# EasyEDA Pro project ProPrj_STM32音响_2025-06-08.epro, schematic Second Test

## Sheets
1 主要供电: Board Name: Second Test; Create Date: 2025-04-06; Page Name: 主要供电; Project Name: STM32多功能音响; Schematic Name: Schematic2; Update Date: 2025-04-14; Company: 嘉立创EDA; Page Size: A4; Version: V1.0
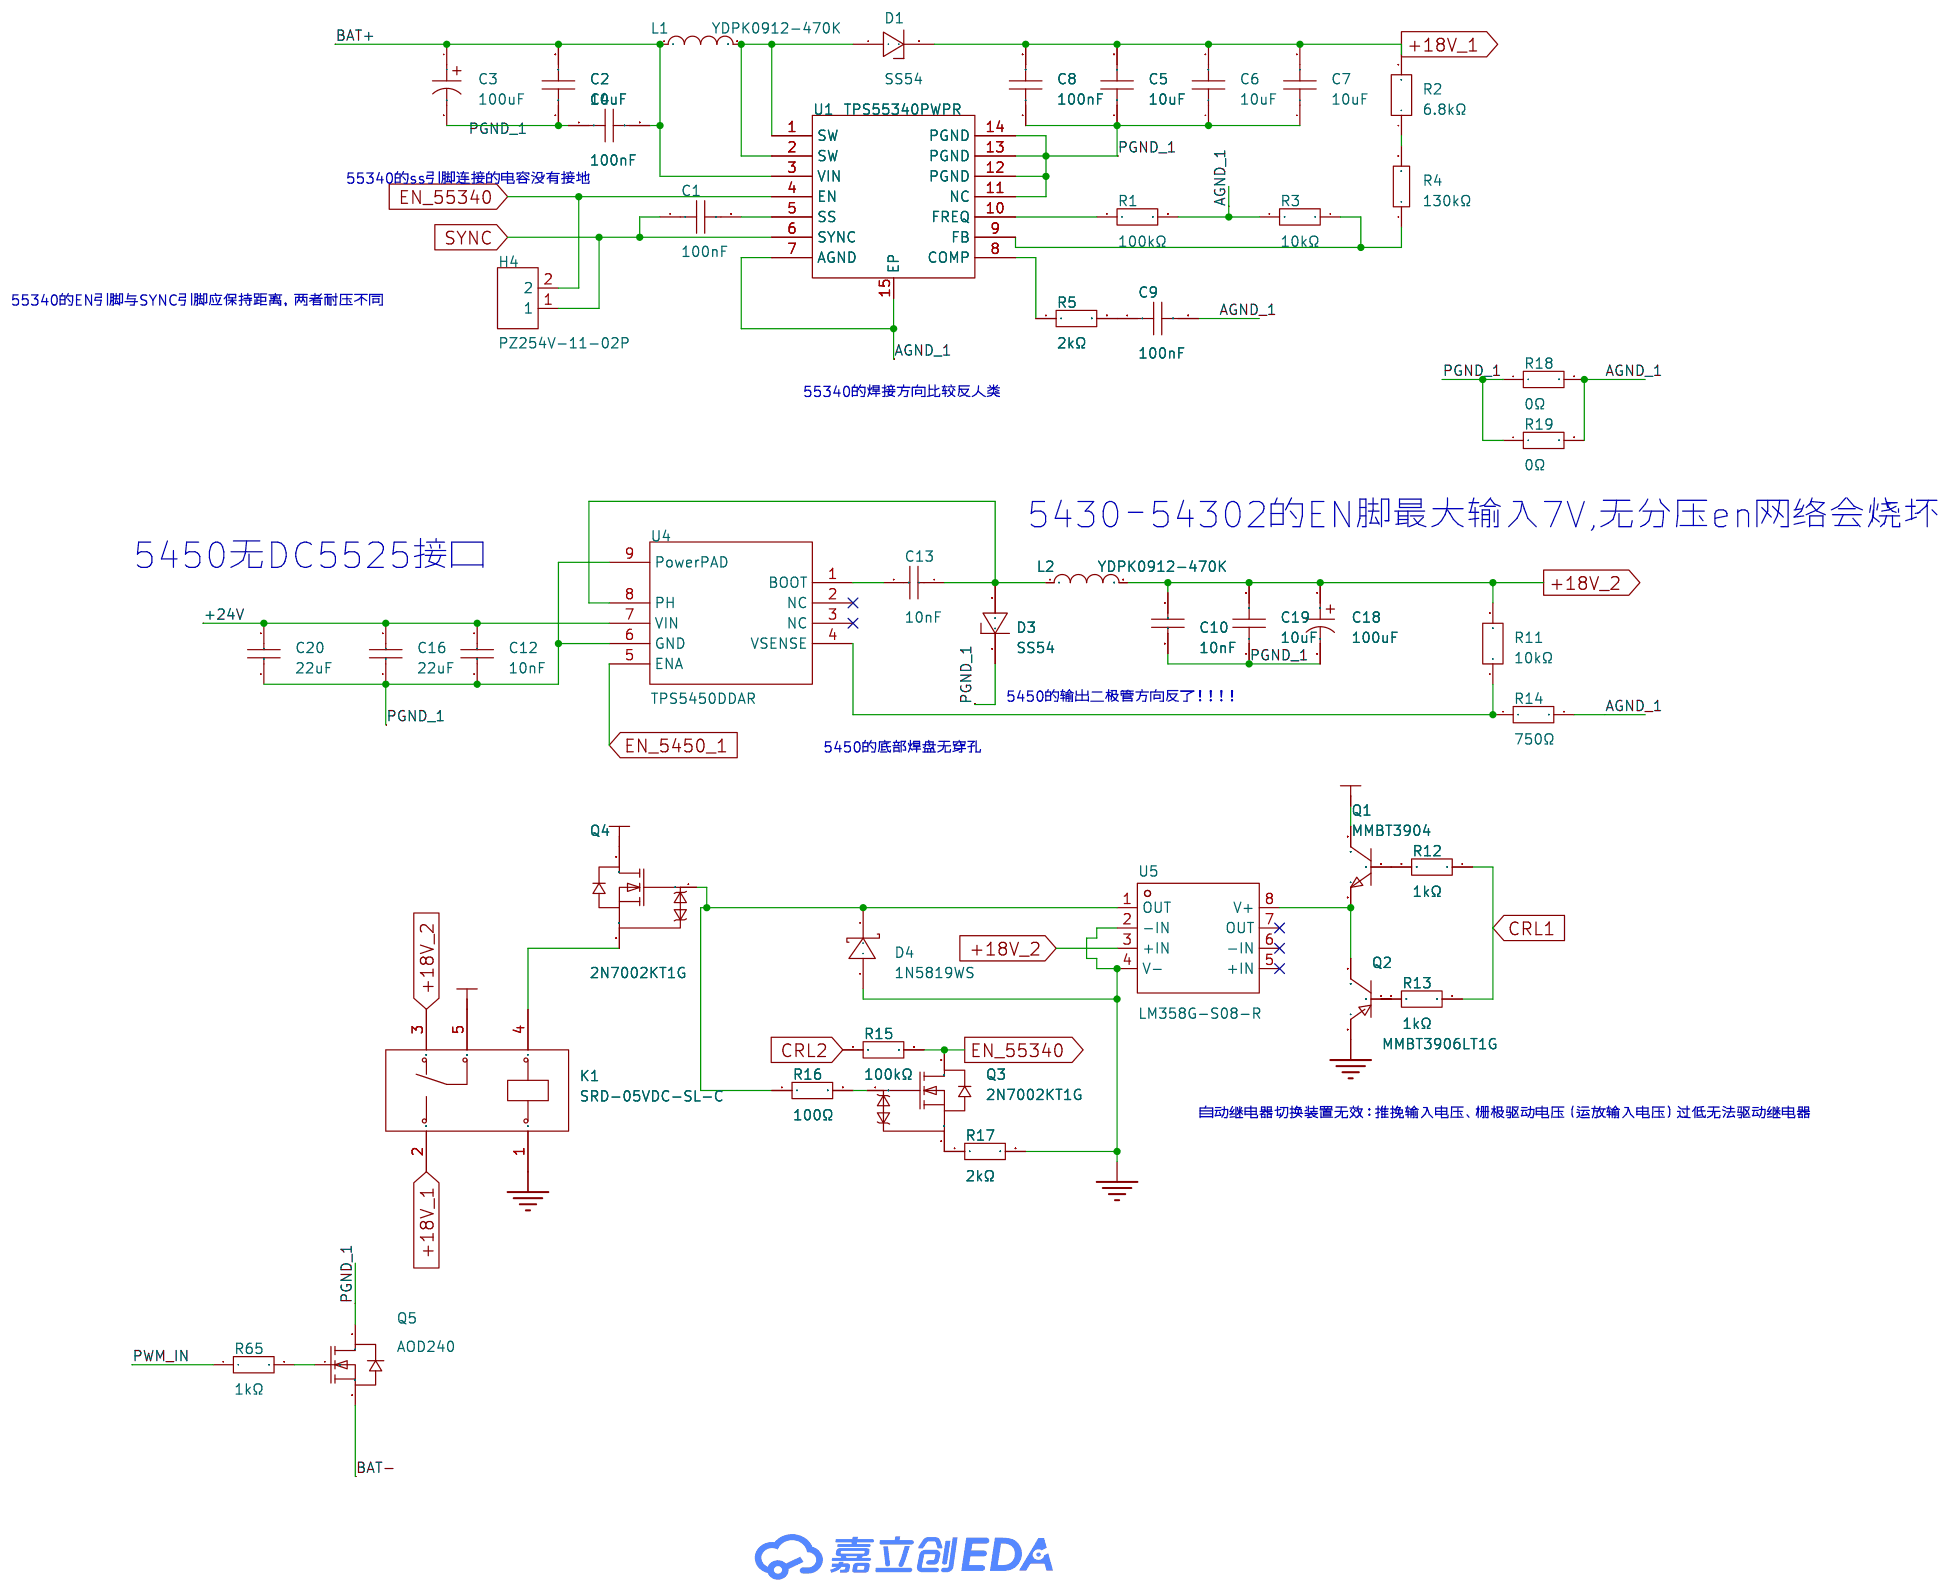
[diagram p5: 主要供电]
2 功放: Create Date: 2025-04-07; Page Name: P2; Update Date: 2025-04-12
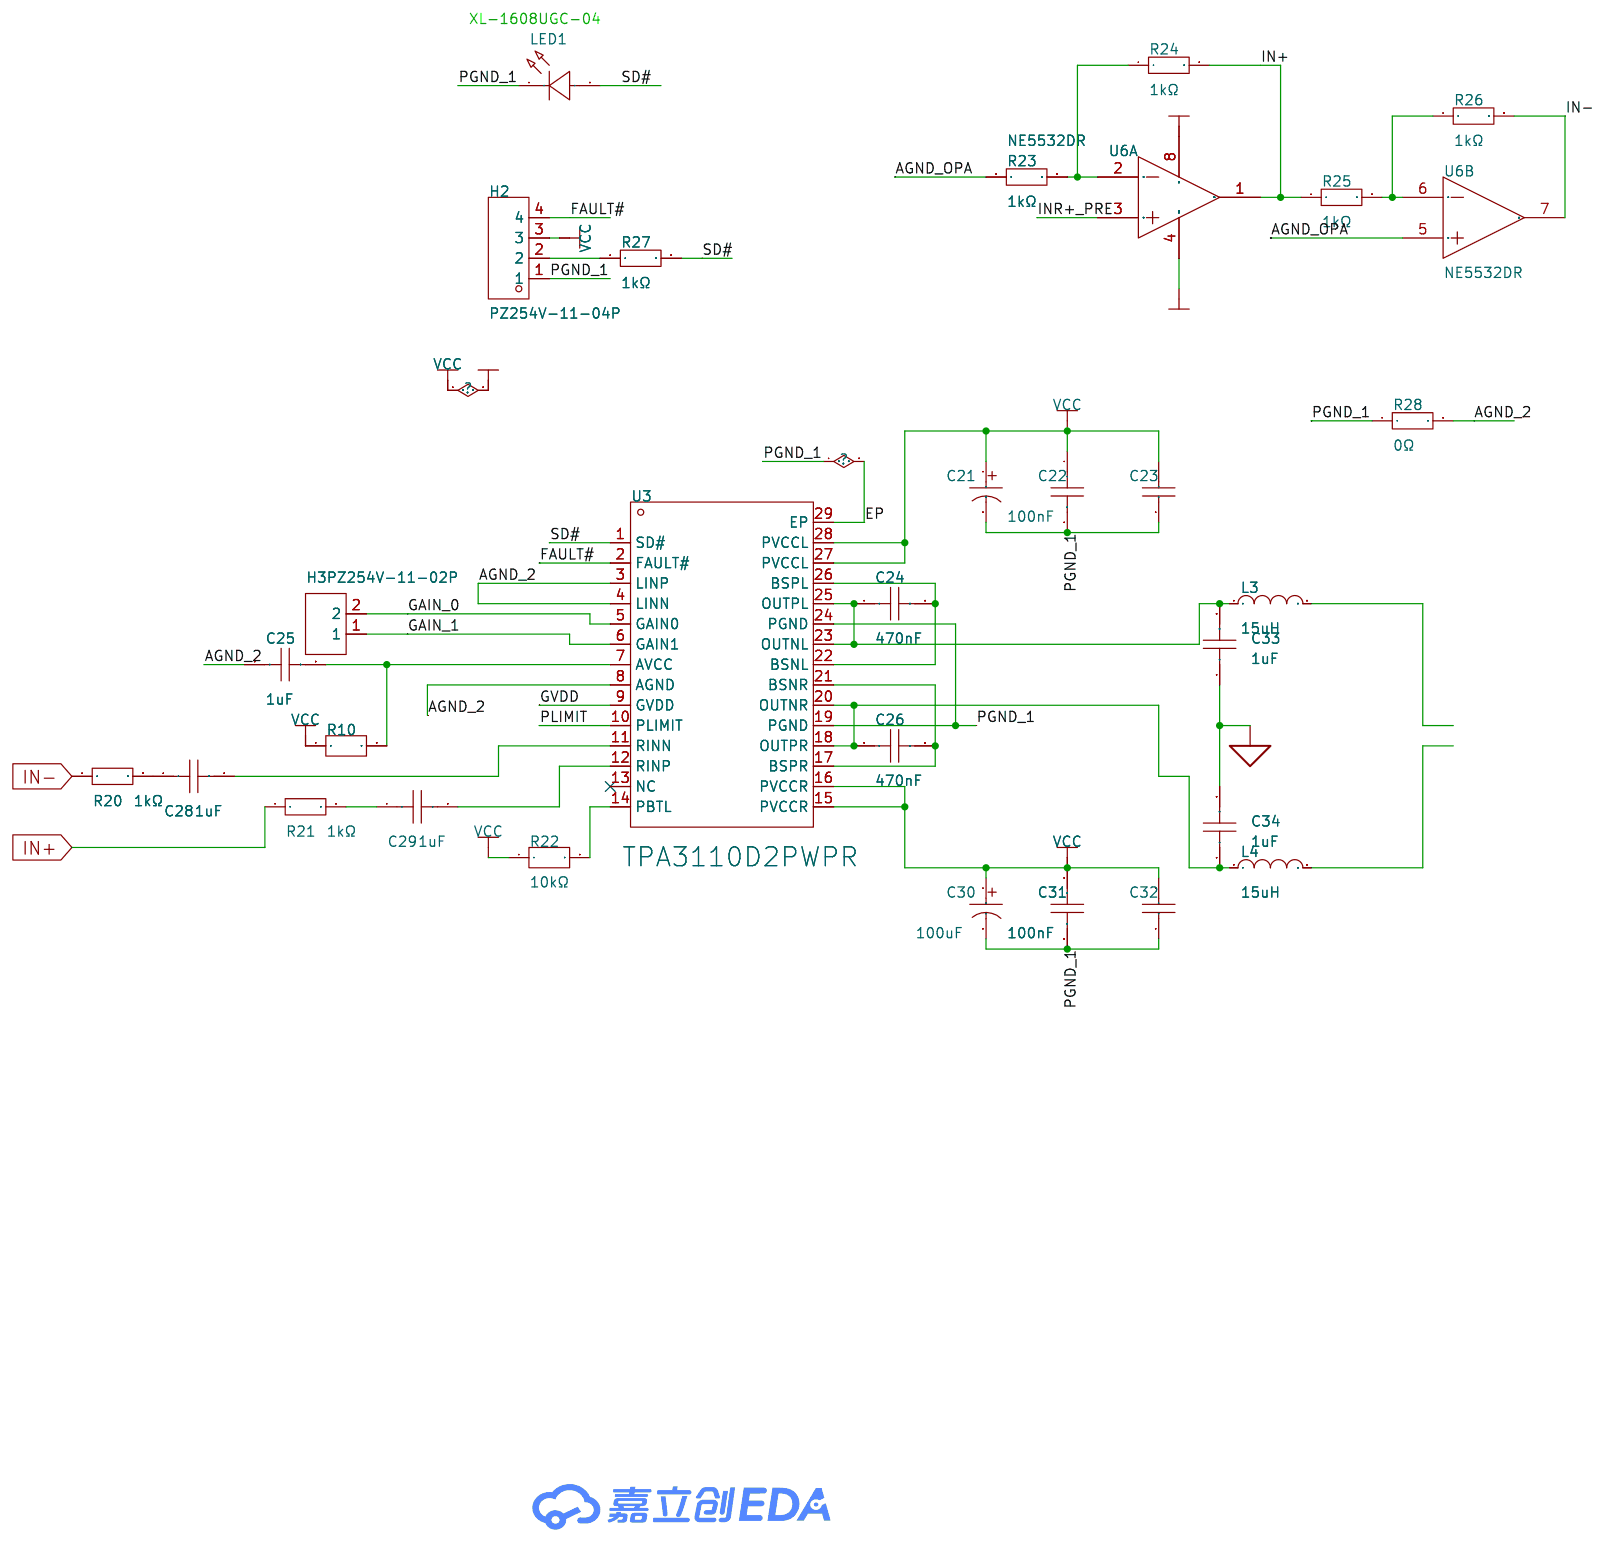
[diagram p6: 功放]
3 运放电源: Create Date: 2025-04-11; Page Name: 运放电源; Update Date: 2025-04-19
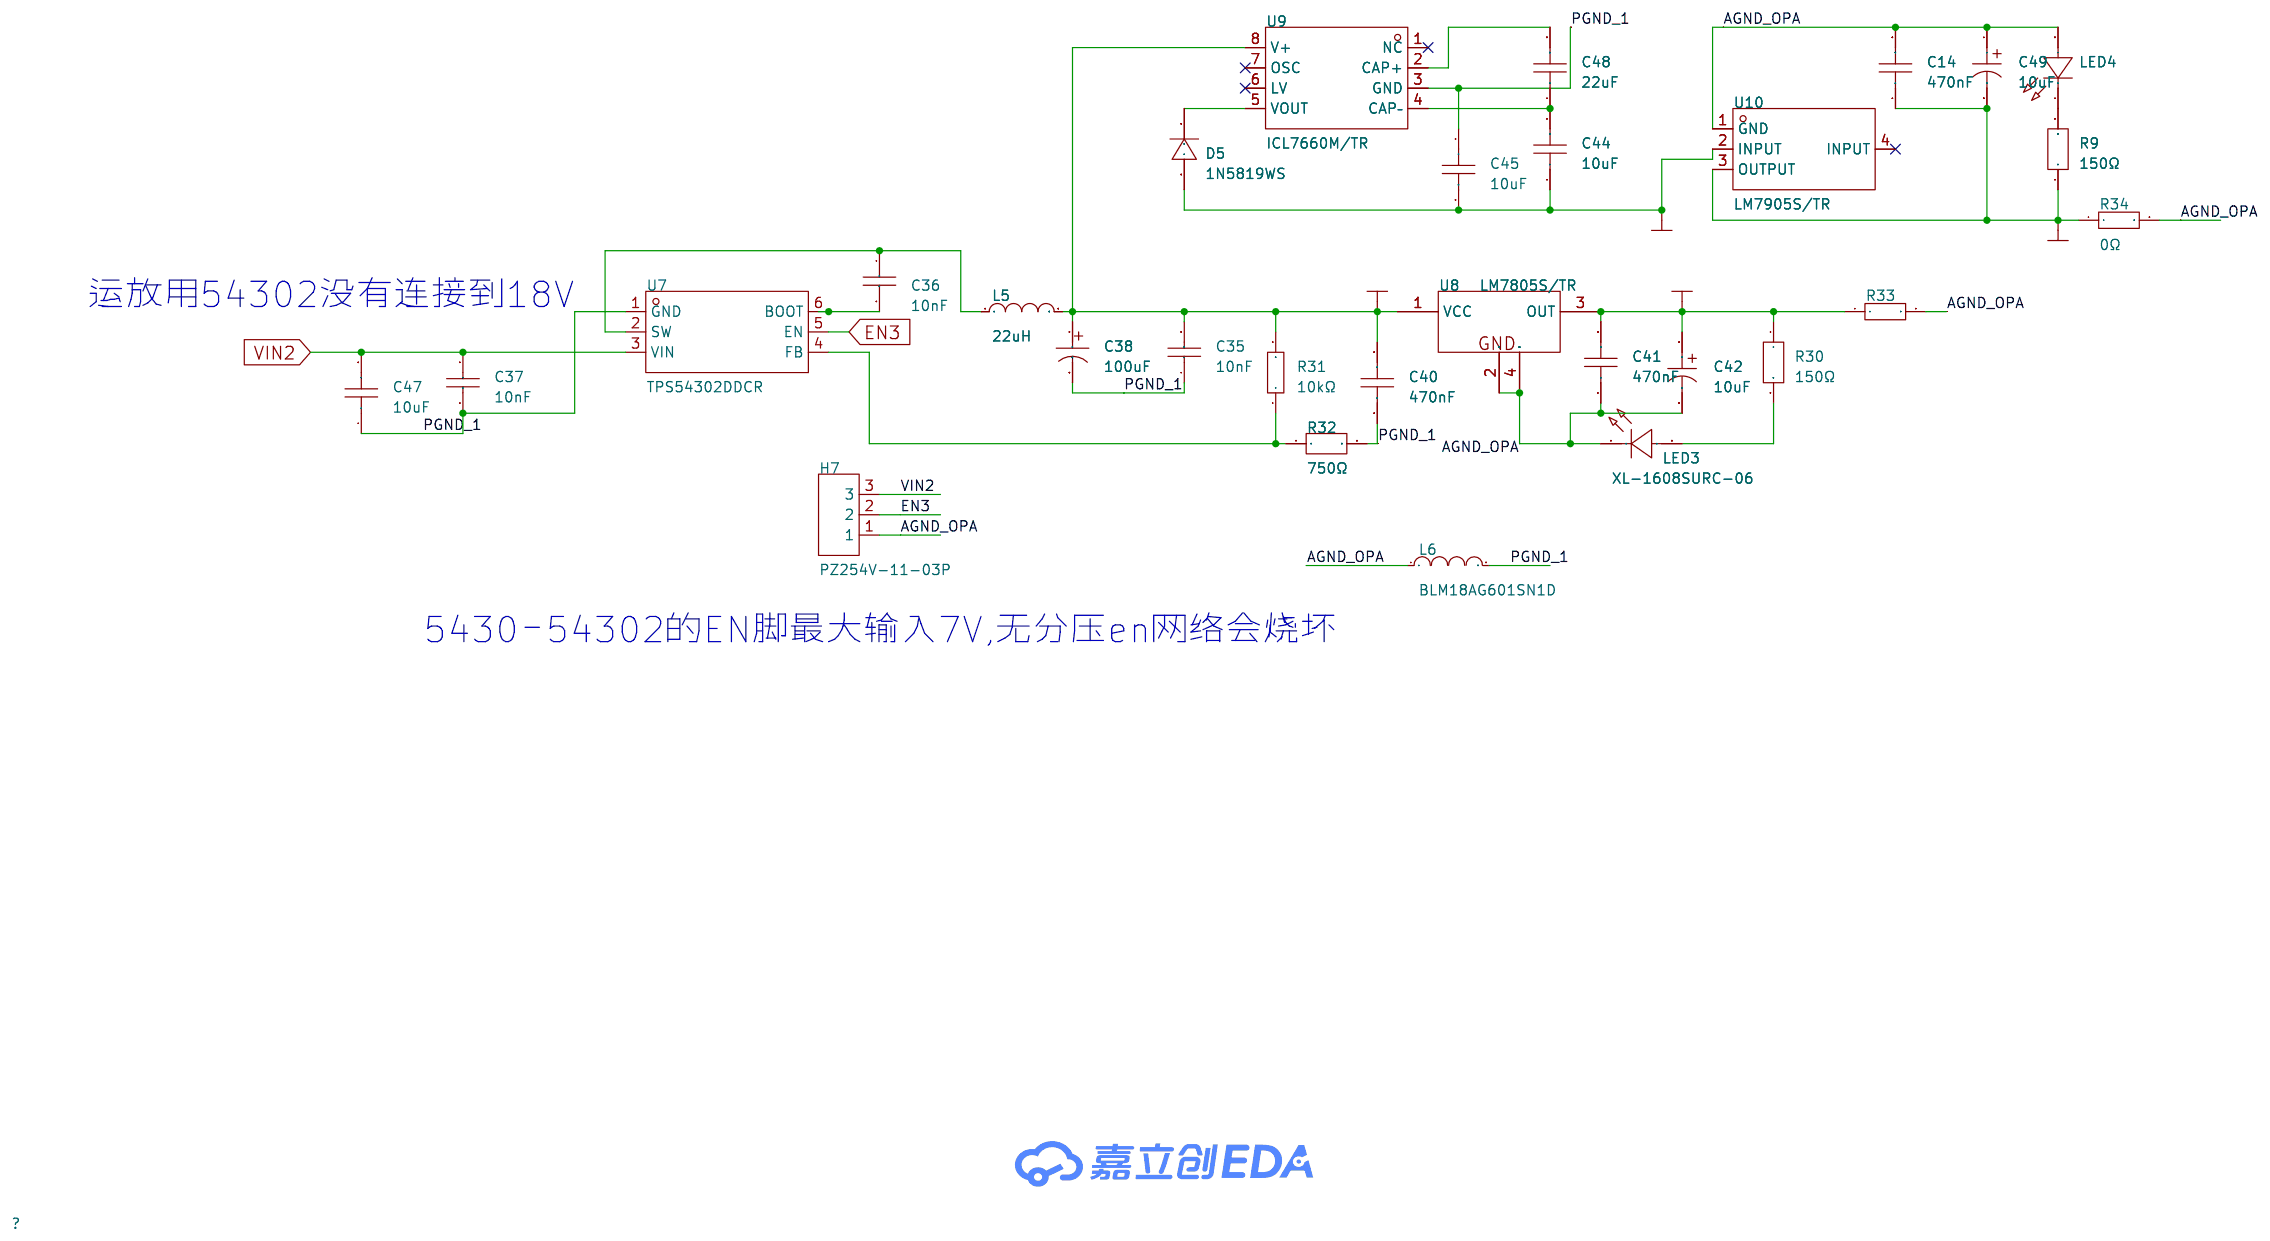
[diagram p7: 运放电源]
4 分频器: Create Date: 2025-04-13; Page Name: 分频器; Update Date: 2025-04-13
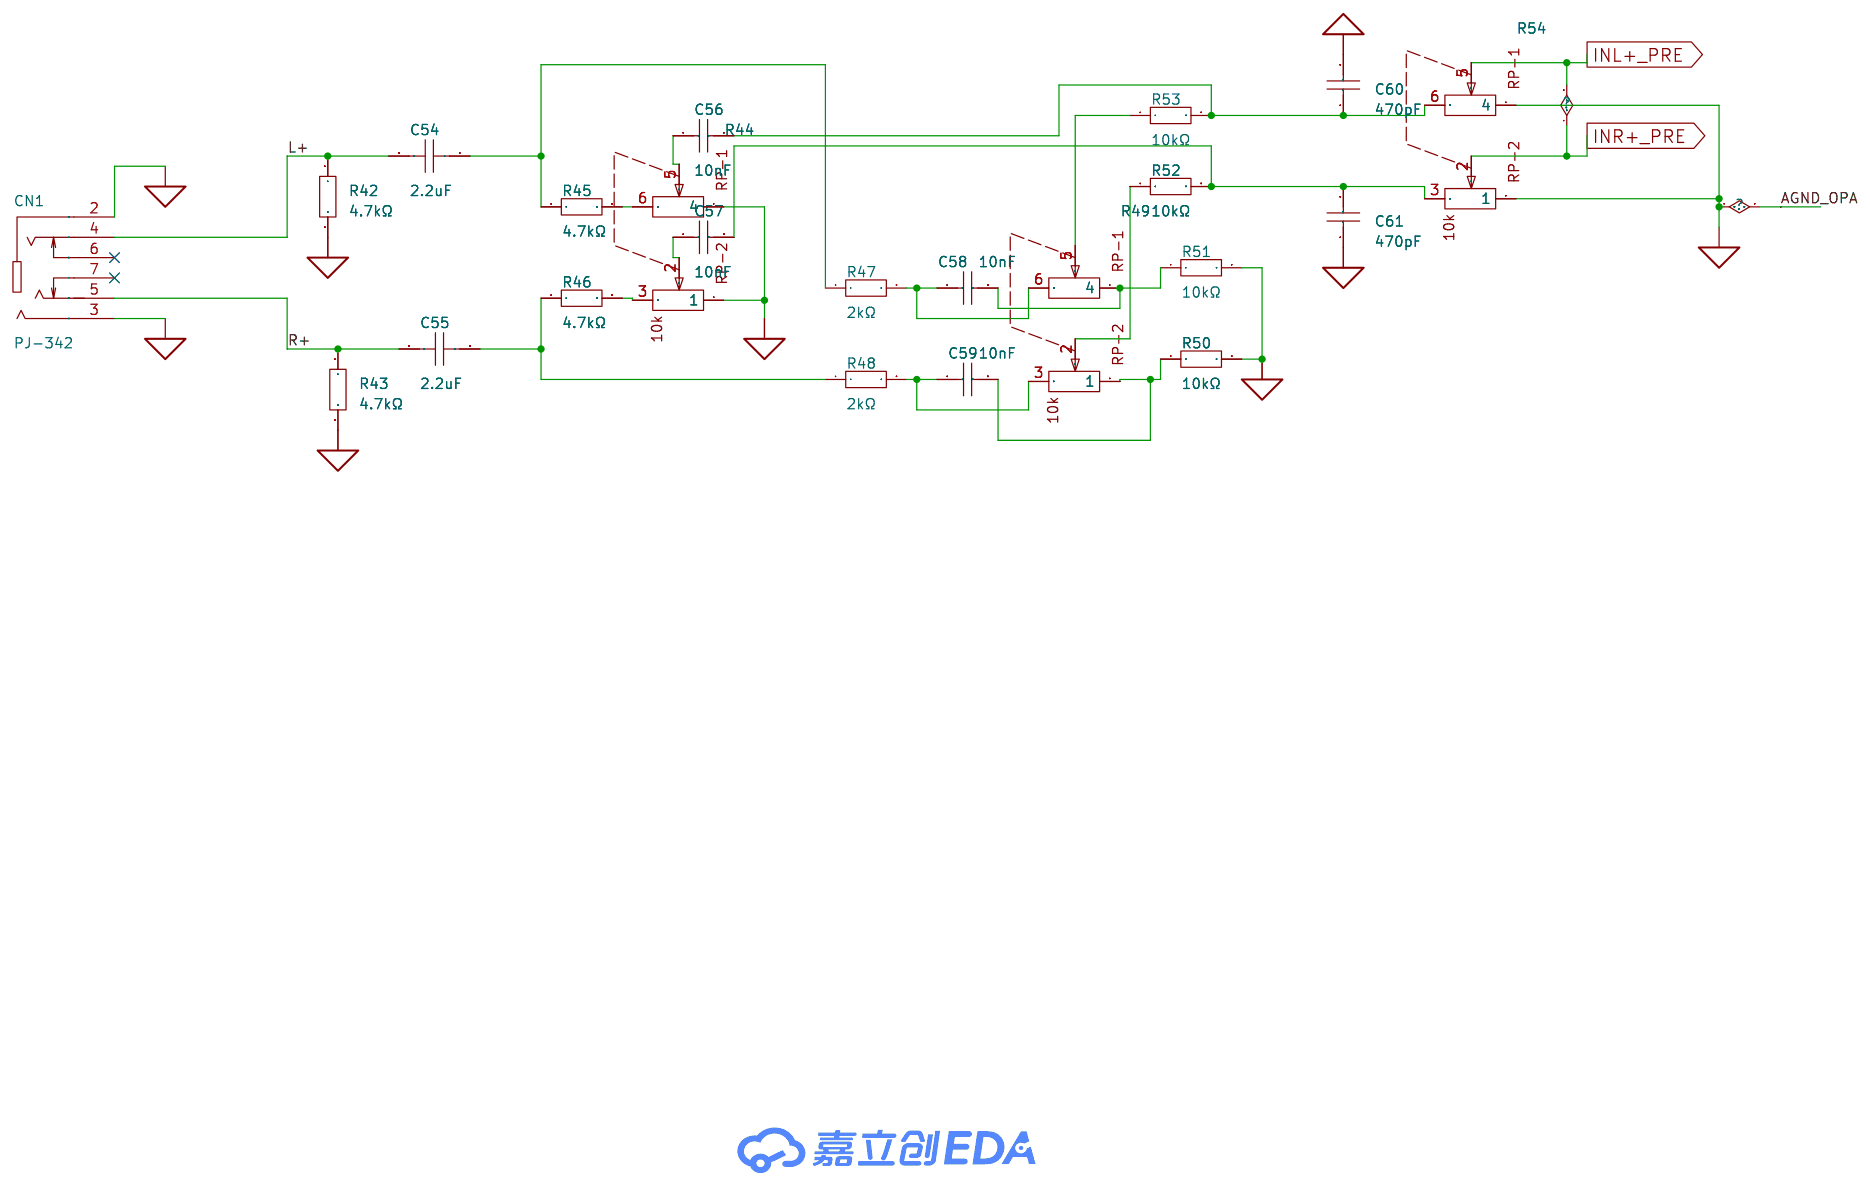
[diagram p8: 分频器]
5 电平: Create Date: 2025-04-13; Page Name: P6; Update Date: 2025-04-13
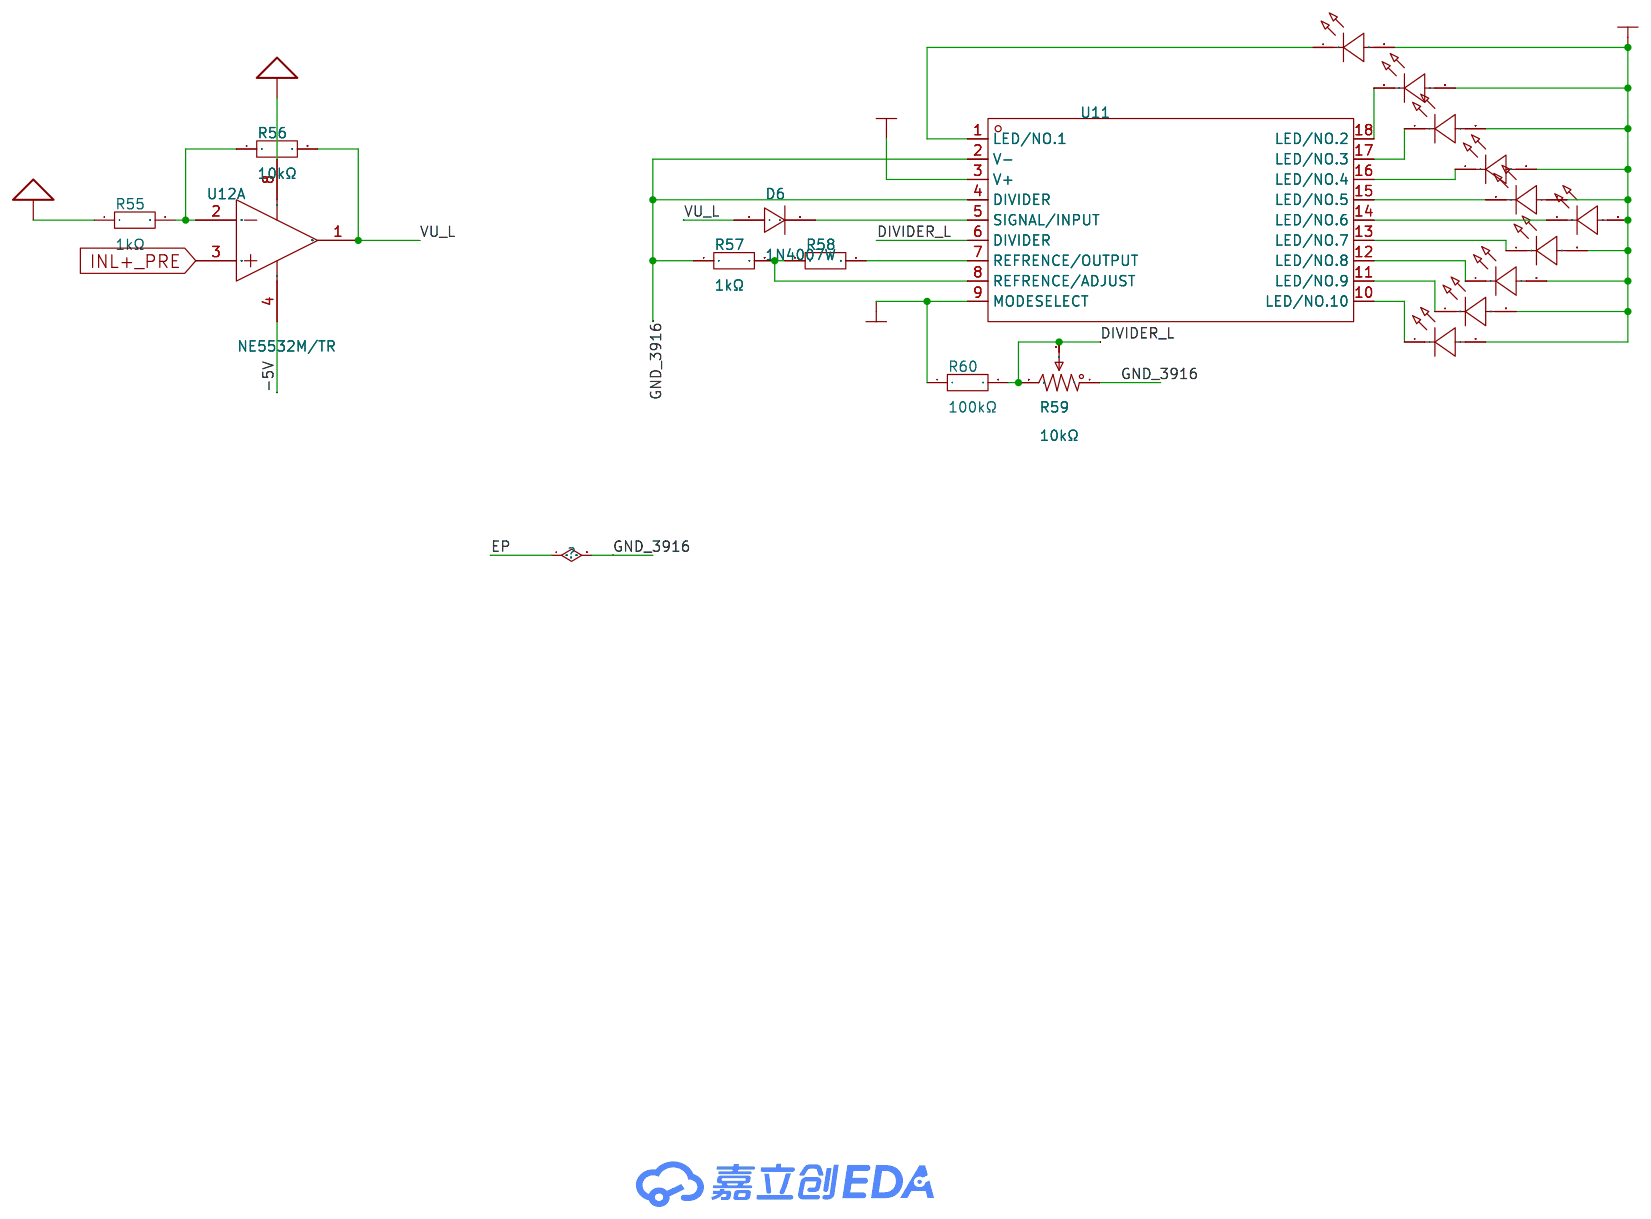
[diagram p9: 电平]
6 单片机电源: Create Date: 2025-04-13; Page Name: 单片机电源; Update Date: 2025-04-19
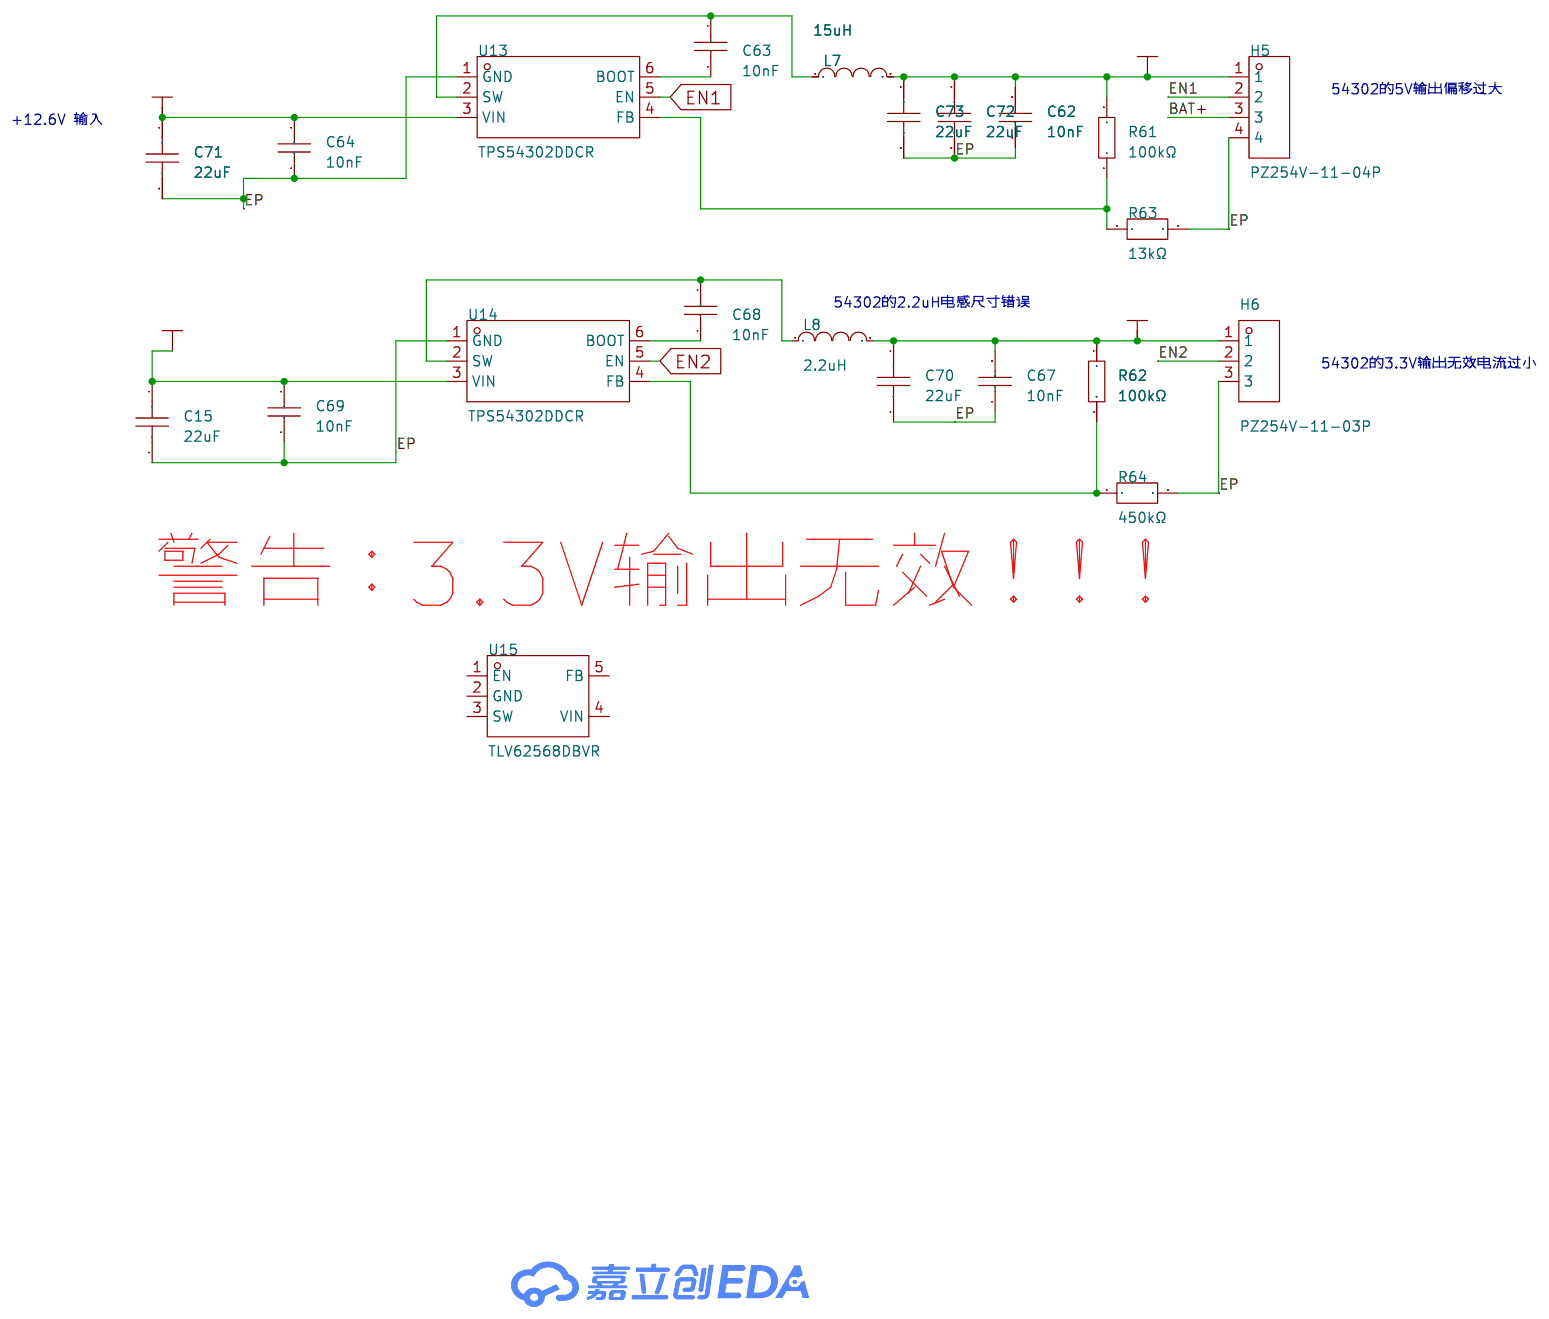
[diagram p10: 单片机电源]

## Parts
sheet 主要供电
C1  100nF  [C0603]
C2  10uF  [C0805]
C3  100uF  [CAP-TH_BD8.0-P3.50-D0.6-FD]
C4  100nF  [C0603]
C5  10uF  [C0805]
C6  10uF  [C0805]
C7  10uF  [C0805]
C8  100nF  [C0603]
C9  100nF  [C0603]
C10  10nF  [C0603]
C12  10nF  [C0603]
C13  10nF  [C0603]
C16  22uF  [C0805]
C18  100uF  [CAP-TH_BD8.0-P3.50-D0.6-FD]
C19  10uF  [C0805]
C20  22uF  [C0805]
D1  SS54  [SMA_L4.3-W2.6-LS5.0-FD]
D3  SS54  [SMA_L4.3-W2.6-LS5.0-FD]
D4  1N5819WS  [SOD-323_L1.8-W1.3-LS2.5-RD]
H4  PZ254V-11-02P  [HDR-TH_2P-P2.54-V-M]
K1  SRD-05VDC-SL-C  [RELAY-TH_SRD-XXVDC-XL-C]
L1  YDPK0912-470K  [IND-TH_BD11.0-P5.00-D0.6]
L2  YDPK0912-470K  [IND-TH_BD11.0-P5.00-D0.6]
Q1  MMBT3904  [SOT-23-3_L2.9-W1.3-P1.90-LS2.4-BR]
Q2  MMBT3906LT1G  [SOT-23-3_L2.9-W1.3-P1.90-LS2.4-BR]
Q3  2N7002KT1G  [SOT-23-3_L2.9-W1.3-P1.90-LS2.4-BR]
Q4  2N7002KT1G  [SOT-23-3_L2.9-W1.3-P1.90-LS2.4-BR]
Q5  AOD240  [TO-252-2_L6.6-W6.1-P4.60-LS10.0-BR-CW]
R1  100kΩ  [R0603]
R2  6.8kΩ  [R0603]
R3  10kΩ  [R0603]
R4  130kΩ  [R0603]
R5  2kΩ  [R0603]
R11  10kΩ  [R0603]
R12  1kΩ  [R0603]
R13  1kΩ  [R0603]
R14  750Ω  [R0603]
R15  100kΩ  [R0603]
R16  100Ω  [R0603]
R17  2kΩ  [R0603]
R18  0Ω  [R1206]
R19  0Ω  [R1206]
R65  1kΩ  [R0603]
U1  TPS55340PWPR  [HTSSOP-14_L5.0-W4.4-P0.65-LS6.4-BL-EP]
U4  TPS5450DDAR  [ESOP-8_L4.9-W3.9-P1.27-LS6.0-TL-EP]
U5  LM358G-S08-R  [SOIC-8_L5.0-W4.0-P1.27-LS6.0-BL]
sheet 分频器
C54  2.2uF  [C0805]
C55  2.2uF  [C0805]
C56  10nF  [C0603]
C57  10nF  [C0603]
C58  10nF  [C0603]
C59  10nF  [C0603]
C60  470pF  [C0805]
C61  470pF  [C0805]
CN1  PJ-342  [AUDIO-SMD_PJ-342]
R42  4.7kΩ  [R0603]
R43  4.7kΩ  [R0603]
R44  -  [DIP-6 For RK09L]
R45  4.7kΩ  [R0603]
R46  4.7kΩ  [R0603]
R47  2kΩ  [R0603]
R48  2kΩ  [R0603]
R49  -  [DIP-6 For RK09L]
R50  10kΩ  [R0603]
R51  10kΩ  [R0603]
R52  10kΩ  [R0603]
R53  10kΩ  [R0603]
R54  -  [DIP-6 For RK09L]
sheet 功放
C21  100uF  [CAP-TH_BD8.0-P3.50-D0.6-FD]
C22  100nF  [C0603]
C23  1nF  [C0603]
C24  470nF  [CAP-SMD_L1.6-W0.8-3]
C25  1uF  [C0603]
C26  470nF  [CAP-SMD_L1.6-W0.8-3]
C28  1uF  [C0603]
C29  1uF  [C0603]
C30  100uF  [CAP-TH_BD8.0-P3.50-D0.6-FD]
C31  100nF  [C0603]
C32  1nF  [C0603]
C33  1uF  [C0603]
C34  1uF  [C0603]
H2  PZ254V-11-04P  [HDR-TH_4P-P2.54-V-M]
H3  PZ254V-11-02P  [HDR-TH_2P-P2.54-V-M]
L3  15uH  [IND-SMD_L11.5-W10.0_FXL1040]
L4  15uH  [IND-SMD_L11.5-W10.0_FXL1040]
LED1  XL-1608UGC-04  [LED0603-RD_GREEN]
R10  10Ω  [R1206]
R20  1kΩ  [R0603]
R21  1kΩ  [R0603]
R22  10kΩ  [R0603]
R23  1kΩ  [R0603]
R24  1kΩ  [R0603]
R25  1kΩ  [R0603]
R26  1kΩ  [R0603]
R27  1kΩ  [R0603]
R28  0Ω  [R1206]
U3  TPA3110D2PWPR  [TSSOP-28_L9.7-W4.4-P0.65-LS6.4-BL-EP6.2]
U6  NE5532DR  [SOIC-8_L4.9-W3.9-P1.27-LS6.0-BL]  (sections 1,2)
sheet 单片机电源
C15  22uF  [C1206]
C62  10nF  [C0603]
C63  10nF  [C0603]
C64  10nF  [C0603]
C67  10nF  [C0603]
C68  10nF  [C0603]
C69  10nF  [C0603]
C70  22uF  [C1206]
C71  22uF  [C1206]
C72  22uF  [C1206]
C73  22uF  [C1206]
H5  PZ254V-11-04P  [HDR-TH_4P-P2.54-V-M]
H6  PZ254V-11-03P  [HDR-TH_3P-P2.54-V-M]
L7  15uH  [IND-SMD_L7.0-W6.6_FXL0630]
L8  2.2uH  [IND-SMD_L3.0-W3.0_FNR30XXS]
R61  100kΩ  [R0603]
R62  100kΩ  [R0603]
R63  13kΩ  [R0603]
R64  450kΩ  [R0402]
U13  TPS54302DDCR  [SOT-23-6_L2.9-W1.6-P0.95-LS2.8-BL]
U14  TPS54302DDCR  [SOT-23-6_L2.9-W1.6-P0.95-LS2.8-BL]
U15  TLV62568DBVR  [SOT-23-5_L3.0-W1.7-P0.95-LS2.8-BR]
sheet 电平
D6  1N4007W  [SOD-123FL_L2.7-W1.8-LS3.8-RD]
LED11  XL-1608SURC-06  [LED0603-RD_RED]
LED12  XL-1608SURC-06  [LED0603-RD_RED]
LED13  XL-1608SURC-06  [LED0603-RD_RED]
LED14  XL-1608SURC-06  [LED0603-RD_RED]
LED15  XL-1608SURC-06  [LED0603-RD_RED]
LED16  XL-1608SURC-06  [LED0603-RD_RED]
LED17  XL-1608SURC-06  [LED0603-RD_RED]
LED18  XL-1608SURC-06  [LED0603-RD_RED]
LED19  XL-1608SURC-06  [LED0603-RD_RED]
LED20  XL-1608SURC-06  [LED0603-RD_RED]
R55  1kΩ  [R0603]
R56  10kΩ  [R0603]
R57  1kΩ  [R0603]
R58  1kΩ  [R0603]
R59  10kΩ  [RES-ADJ-TH_3362P]
R60  100kΩ  [R0603]
U11  LM3916N  [PDIP-18_L22.9-W6.4-P2.54-LS7.9-BL]
U12  NE5532M/TR  [SOP-8_L4.9-W3.9-P1.27-LS6.0-BL]  (section 1)
sheet 运放电源
C14  470nF  [C0603]
C35  10nF  [C0603]
C36  10nF  [C0603]
C37  10nF  [C0603]
C38  100uF  [CAP-TH_BD8.0-P3.50-D0.6-FD]
C40  470nF  [C0603]
C41  470nF  [C0603]
C42  10uF  [CAP-SMD_BD4.0-L4.3-W4.3-LS5.0-FD]
C44  10uF  [C1206]
C45  10uF  [C1206]
C47  10uF  [C1206]
C48  22uF  [C0805]
C49  10uF  [CAP-SMD_BD4.0-L4.3-W4.3-LS5.0-FD]
D5  1N5819WS  [SOD-323_L1.8-W1.3-LS2.5-RD]
H7  PZ254V-11-03P  [HDR-TH_3P-P2.54-V-M]
L5  22uH  [IND-SMD_L7.1-W6.6]
L6  BLM18AG601SN1D  [L0603]
LED3  XL-1608SURC-06  [LED0603-RD_RED]
LED4  XL-1608UGC-04  [LED0603-RD_GREEN]
R9  150Ω  [R0603]
R30  150Ω  [R0603]
R31  10kΩ  [R0603]
R32  750Ω  [R0603]
R33  0Ω  [R1206]
R34  0Ω  [R1206]
U7  TPS54302DDCR  [SOT-23-6_L2.9-W1.6-P0.95-LS2.8-BL]
U8  LM7805S/TR  [TO-263-3_L8.6-W10.2-P2.54-LS14.4-BR]
U9  ICL7660M/TR  [SOP-8_L4.9-W3.9-P1.27-LS6.0-BL]
U10  LM7905S/TR  [TO-263-3L_L10.2-W8.6-P2.54-LS14.4-TL]

## Library data of the parts
C1 C4 C8 C9 C22 C31 = CGA0603X7R104K500JT: 容值:100nF;精度:±10%;额定电压:50V;材质(温度系数):X7R;; LCSC Part Name: 100nF ±10% 50V; Supplier Part: C6119867; Manufacturer: HRE(芯声); Supplier Footprint: 0603; JLCPCB Part Class: Extended Part; Supplier: LCSC; Tolerance: ±10%; Voltage Rated: 50V; Temperature Coefficient: X7R
C2 C5-C7 C19 = GRM21BR61H106KE43L: 容值:10uF;精度:±10%;额定电压:50V;材质(温度系数):X5R;; LCSC Part Name: 10uF ±10% 50V; Supplier Part: C440198; Manufacturer: muRata(村田); Supplier Footprint: 0805; JLCPCB Part Class: Basic Part; Datasheet: https://atta.szlcsc.com/upload/public/pdf/source/20230811/95AAE0C9AF55EDC31B7A4D8B733F534E.pdf; Supplier: LCSC; Tolerance: ±10%; Voltage Rated: 50V; Temperature Coefficient: X5R
C3 C18 = KNH4100UF50V149EC0024: 容值:100uF;精度:±20%;额定电压:50V;纹波电流:-;等效串联电阻(ESR):-;类型:-;; LCSC Part Name: 100uF ±20% 50V; Supplier Part: C2927900; Manufacturer: KNSCHA(科尼盛); Supplier Footprint: 插件,D8xL12mm; JLCPCB Part Class: 扩展库; Datasheet: https://atta.szlcsc.com/upload/public/pdf/source/20220426/FBA31D3684889FAFEB49FEEB0664C4A4.pdf; Supplier: LCSC; Tolerance: ±20%; Voltage Rating: 50V; Diameter: 8mm; Height - Seated (Max): 12mm; Operating Temperature: -55℃~+125℃
C10 C12 C13 C35-C37 C56-C59 C62-C64 C67-C69 = CC0603KRX7R9BB103: 容值:10nF;精度:±10%;额定电压:50V;材质(温度系数):X7R;; LCSC Part Name: 10nF ±10% 50V; Supplier Part: C100042; Manufacturer: YAGEO(国巨); Supplier Footprint: 0603; JLCPCB Part Class: 扩展库; Datasheet: https://atta.szlcsc.com/upload/public/pdf/source/20181008/C309510_22F155564471FAF6A489F7D68F34234E.pdf; Supplier: LCSC; Tolerance: ±10%; Voltage Rated: 50V; Temperature Coefficient: X7R
C16 C20 C48 = CGA0805X5R226M350MT: 容值:22uF;精度:±20%;额定电压:35V;材质(温度系数):X5R;; LCSC Part Name: 22uF ±20% 35V; Supplier Part: C6119901; Manufacturer: HRE(芯声); Supplier Footprint: 0805; JLCPCB Part Class: Extended Part; Datasheet: https://atta.szlcsc.com/upload/public/pdf/source/20231129/D589D0CC4D260F7AC3A77E53B455CCB3.pdf; Supplier: LCSC; Tolerance: ±20%; Voltage Rated: 35V; Temperature Coefficient: X5R
D1 = SS54_C7420369: 二极管配置:独立式;正向压降(Vf):550mV@5.0A;直流反向耐压(Vr):40V;整流电流:5A;; LCSC Part Name: 电压:40V 电流:5A; Supplier Part: C7420369; Manufacturer: 宏迦橙; Supplier Footprint: SMA(DO-214AC); JLCPCB Part Class: 扩展库; Datasheet: https://atta.szlcsc.com/upload/public/pdf/source/20230828/254C3882F8647358AD9F60DD73611B5E.pdf; Supplier: LCSC; Diode Configuration: 独立式; Forward Voltage (Vf@If): 550mV@5.0A; Reverse Voltage (Vr): 40V; Rectified Current: 5A; Reverse Leakage Current (Ir): 50uA@40V
D3 = SS54_C7420369: 二极管配置:独立式;正向压降(Vf):550mV@5.0A;直流反向耐压(Vr):40V;整流电流:5A;; LCSC Part Name: 电压:40V 电流:5A; Supplier Part: C7420369; Manufacturer: 宏迦橙; Supplier Footprint: SMA(DO-214AC); JLCPCB Part Class: Extended Part; Datasheet: https://atta.szlcsc.com/upload/public/pdf/source/20230828/254C3882F8647358AD9F60DD73611B5E.pdf; Supplier: LCSC; Diode Configuration: 独立式; Forward Voltage (Vf@If): 550mV@5.0A; Reverse Voltage (Vr): 40V; Rectified Current: 5A; Reverse Leakage Current (Ir): 50uA@40V
D4 = 1N5819WS_C191023: 正向压降(Vf):600mV@1A;直流反向耐压(Vr):40V;整流电流:1A;; LCSC Part Name: 电压:40V 电流:1A; Supplier Part: C191023; Manufacturer: Hottech(合科泰); Supplier Footprint: SOD-323; JLCPCB Part Class: 基础库; Datasheet: https://atta.szlcsc.com/upload/public/pdf/source/20220428/3CB86FD8D28D653594B4E35F9D5AEFD9.pdf; Supplier: LCSC; Forward Voltage (Vf@If): 600mV@1A; Reverse Voltage (Vr): 40V; Rectified Current: 1A
H3 H4 = PZ254V-11-02P: 插针结构:1x2P;间距:2.54mm;行距:-;圆针/方针:方针;安装方式:直插;排数:单排;总PIN位数:2P;额定电流:-;额定电压:-;配合针长度:6mm;塑高:2.5mm;端接针长度:3mm;触头材质:黄铜;触头镀层:-;工作温度:-40℃~+105℃;颜色:黑色;; LCSC Part Name: 1x2P 间距:2.54mm 方针 直插; Supplier Part: C492401; Manufacturer: XFCN(兴飞); Supplier Footprint: 插件,P=2.54mm; JLCPCB Part Class: 扩展库; Datasheet: https://atta.szlcsc.com/upload/public/pdf/source/20200309/C492401_A812433581A9B211A7FFA413ADDFF0E5.pdf; Supplier: LCSC; Pin Structure: 1x2P; Pitch: 2.54mm; Circluar Pins/Square Pins: 方针; Mounting Type: 直插; Number of Rows: 单排; Number of Pins: 2P; Length of Mating Pin: 6mm; Insulation Height: 2.5mm; Length of End Connection Pin: 3mm; Contact Material: 黄铜; Operating Temperature: -40℃~+105℃; Color: 黑色
K1 = SRD-05VDC-SL-C: 线圈电压:5V;触点形式:一组转换:1C(单刀双掷-转换);触点容量(电阻负载):-;最大切换电压:250V@AC;最大切换电流:15A;; LCSC Part Name: 蓝色; Supplier Part: C35449; Manufacturer: 松乐; Supplier Footprint: 插件,15.6x19.2mm; JLCPCB Part Class: Extended Part; Datasheet: https://atta.szlcsc.com/upload/public/pdf/source/20200305/C490149_C96E4098A3B1FFB377D5AD2E40B7C2A8.pdf; Supplier: LCSC; Coil Voltage: 5V; Contact Form: 一组转换:1C(单刀双掷-转换); Pin Number: 5; Maximum Switching Voltage: 250V@AC; Coil Rated Power: 360mW; Maximum Switching Current: 15A; Coil Type: 无极性-单线圈; Coil Resistance: 70Ω; Contact Resistance: 100mΩ; Operate Time: 10ms; Release Time: 10ms
L1 L2 = YDPK0912-470K: 电感值：47uH 精度：±10% 饱和电流：3.0A 直流电阻(DCR)：115mΩ Max. 工字电感 DR2W9*12 长脚; LCSC Part Name: 9*12 47uH ±10% 3A 115mΩ; Supplier Part: C22395842; Manufacturer: YJYCOIN(益嘉源); Supplier Footprint: 插件,D11xL15mm; JLCPCB Part Class: Extended Part; Datasheet: https://atta.szlcsc.com/upload/public/pdf/source/20240511/E38727AF61E03A2C575868D4A17557A5.pdf; Supplier: LCSC
Q1 = MMBT3904_C7420353: 晶体管类型:NPN;集电极电流(Ic):200mA;集射极击穿电压(Vceo):40V;耗散功率(Pd):200mW;直流电流增益(hFE):100@10mA,1.0V;; LCSC Part Name: hFE:200-300，丝印:1AM MMBT3904; Supplier Part: C7420353; Manufacturer: 宏嘉诚; Supplier Footprint: SOT-23; JLCPCB Part Class: Extended Part; Datasheet: https://atta.szlcsc.com/upload/public/pdf/source/20250107/C89EF9052A149FE4921E3DCD6BE55193.pdf; Supplier: LCSC; type: NPN; Current - Collector(Ic): 200mA; Collector - Emitter Voltage VCEO: 40V; Pd - Power Dissipation: 200mW; DC Current Gain: 100@10mA,1.0V; Transition frequency(fT): 300MHz; Current - Collector Cutoff: 100nA; Vce Saturation(VCE(sat)): 300mV; Operating Temperature: -55℃~+150℃
Q2 = MMBT3906LT1G: 晶体管类型:PNP;集电极电流(Ic):200mA;集射极击穿电压(Vceo):40V;功率(Pd):225mW;直流电流增益(hFE@Ic,Vce):60@0.1mA,1.0V;; LCSC Part Name: PNP 电流:200mA 耐压:40V; Supplier Part: C53444; Manufacturer: onsemi(安森美); Supplier Footprint: SOT-23(TO-236); JLCPCB Part Class: 扩展库; Datasheet: https://atta.szlcsc.com/upload/public/pdf/source/20150713/1457707330085.pdf; Supplier: LCSC; Transistor Type: PNP; Collector Current (Ic): 200mA; Collector-Emitter Breakdown Voltage (Vceo): 40V; Power Dissipation (Pd): 225mW; DC Current Gain (hFE@Ic,Vce): 60@0.1mA,1.0V; Transition Frequency (fT): 250MHz; Collector Cut-Off Current (Icbo): 50nA; Collector-Emitter Saturation Voltage (VCE(sat)@Ic,Ib): 250mV@10mA,1.0mA; Operating Temperature: -55℃~+150℃
Q3 Q4 = 2N7002KT1G: 类型:1个N沟道;漏源电压(Vdss):60V;连续漏极电流(Id):380mA;导通电阻(RDS(on)@Vgs,Id):1.6Ω@10V;功率(Pd):420mW;阈值电压(Vgs(th)@Id):2.3V@250uA;; LCSC Part Name: 1个N沟道 耐压:60V 电流:380mA; Supplier Part: C116584; Manufacturer: onsemi(安森美); Supplier Footprint: SOT-23; JLCPCB Part Class: 扩展库; Datasheet: https://atta.szlcsc.com/upload/public/pdf/source/20181015/C116584_1A3DC7447F9AFB3124240F7C0C1A97F0.pdf; Supplier: LCSC; Type: 1个N沟道; Drain Source Voltage (Vdss): 60V; Continuous Drain Current (Id): 380mA; Drain Source On Resistance (RDS(on)@Vgs,Id): 1.6Ω@10V; Power Dissipation (Pd): 420mW; Gate Threshold Voltage (Vgs(th)@Id): 2.3V@250uA; Total Gate Charge (Qg@Vgs): 700pC@10V; Input Capacitance (Ciss@Vds): 45pF@20V; Reverse Transfer Capacitance (Crss@Vds): 5pF@20V; Operating Temperature: -55℃~+150℃
Q5 = AOD240: 类型:1个N沟道;漏源电压(Vdss):40V;连续漏极电流(Id):23A；70A;功率(Pd):2.7W；150W;导通电阻(RDS(on)@Vgs,Id):2.4mΩ@10V,20A;阈值电压(Vgs(th)@Id):2.2V@250uA;; LCSC Part Name: 1个N沟道 耐压:40V 电流:23A 电流:70A; Supplier Part: C2840566; Manufacturer: AOS; Supplier Footprint: TO-252-2; JLCPCB Part Class: 扩展库; Datasheet: https://atta.szlcsc.com/upload/public/pdf/source/20211126/D1B09CB1C385D3503AEA055F709FD99E.pdf; Supplier: LCSC; Type: 1个N沟道; Drain Source Voltage (Vdss): 40V; Continuous Drain Current (Id): 23A；70A; Power Dissipation (Pd): 2.7W；150W; Drain Source On Resistance (RDS(on)@Vgs,Id): 2.4mΩ@10V,20A; Gate Threshold Voltage (Vgs(th)@Id): 2.2V@250uA; Total Gate Charge (Qg@Vgs): 60nC@10V; Input Capacitance (Ciss@Vds): 4.3nF@20V; Reverse Transfer Capacitance (Crss@Vds): 68pF@20V; Operating Temperature: -55℃~+175℃@(Tj)
R1 = RC0603FR-07100KL: 电阻类型:厚膜电阻;阻值:100kΩ;精度:±1%;功率:100mW;最大工作电压:75V;温度系数:±100ppm/℃;; LCSC Part Name: 厚膜电阻 100kΩ ±1% 100mW; Supplier Part: C14675; Manufacturer: YAGEO(国巨); Supplier Footprint: 0603; JLCPCB Part Class: 扩展库; Datasheet: https://atta.szlcsc.com/upload/public/pdf/source/20140324/1457707028752.pdf; Supplier: LCSC; Type: 厚膜电阻; Tolerance: ±1%; Power(Watts): 100mW; Overload Voltage (Max): 75V; Temperature Coefficient: ±100ppm/℃; Operating Temperature Range: -55℃~+155℃
R2 = FRC0603F6801TS: 电阻类型:厚膜电阻;阻值:6.8kΩ;精度:±1%;功率:100mW;最大工作电压:75V;温度系数:±100ppm/℃;; LCSC Part Name: 6.8kΩ ±1% 100mW 厚膜电阻; Supplier Part: C2907055; Manufacturer: FOJAN(富捷); Supplier Footprint: 0603; JLCPCB Part Class: Extended Part; Datasheet: https://atta.szlcsc.com/upload/public/pdf/source/20211221/925EC7D7225764EE0046F22065062C87.pdf; Supplier: LCSC; Type: 厚膜电阻; Tolerance: ±1%; Power(Watts): 100mW; Overload Voltage (Max): 75V; Temperature Coefficient: ±100ppm/℃; Operating Temperature Range: -55℃~+155℃
R3 R31 = 0603WAF1002T5E: 电阻类型:厚膜电阻;阻值:10kΩ;精度:±1%;功率:100mW;最大工作电压:75V;温度系数:±100ppm/℃;; LCSC Part Name: 厚膜电阻 10kΩ ±1% 100mW; Supplier Part: C25804; Manufacturer: UNI-ROYAL(厚声); Supplier Footprint: 0603; JLCPCB Part Class: Basic Part; Datasheet: https://atta.szlcsc.com/upload/public/pdf/source/20200306/C422600_1E6D84923E4A46A82E41ADD87F860B5C.pdf; Supplier: LCSC; Type: 厚膜电阻; Tolerance: ±1%; Power(Watts): 100mW; Overload Voltage (Max): 75V; Temperature Coefficient: ±100ppm/℃; Operating Temperature Range: -55℃~+155℃
R4 = FRC0603F1303TS: 电阻类型:厚膜电阻;阻值:130kΩ;精度:±1%;功率:100mW;最大工作电压:75V;温度系数:±100ppm/℃;; LCSC Part Name: 130kΩ ±1% 100mW 厚膜电阻; Supplier Part: C2906991; Manufacturer: FOJAN(富捷); Supplier Footprint: 0603; JLCPCB Part Class: Extended Part; Datasheet: https://atta.szlcsc.com/upload/public/pdf/source/20211221/925EC7D7225764EE0046F22065062C87.pdf; Supplier: LCSC; Type: 厚膜电阻; Tolerance: ±1%; Power(Watts): 100mW; Overload Voltage (Max): 75V; Temperature Coefficient: ±100ppm/℃; Operating Temperature Range: -55℃~+155℃
R5 R17 R47 R48 = 0603WAF2001T5E: 电阻类型:厚膜电阻;阻值:2kΩ;精度:±1%;功率:100mW;最大工作电压:75V;温度系数:±100ppm/℃;; LCSC Part Name: 2kΩ ±1% 100mW 厚膜电阻; Supplier Part: C22975; Manufacturer: UNI-ROYAL(厚声); Supplier Footprint: 0603; JLCPCB Part Class: 基础库; Datasheet: https://atta.szlcsc.com/upload/public/pdf/source/20200306/C422600_1E6D84923E4A46A82E41ADD87F860B5C.pdf; Supplier: LCSC; Type: 厚膜电阻; Tolerance: ±1%; Power(Watts): 100mW; Overload Voltage (Max): 75V; Temperature Coefficient: ±100ppm/℃; Operating Temperature Range: -55℃~+155℃
R11 R22 = FRC0603J103TS: 电阻类型:厚膜电阻;阻值:10kΩ;精度:±5%;功率:100mW;最大工作电压:75V;温度系数:±100ppm/℃;; LCSC Part Name: 10kΩ ±5% 100mW 厚膜电阻; Supplier Part: C2930027; Manufacturer: FOJAN(富捷); Supplier Footprint: 0603; JLCPCB Part Class: Extended Part; Datasheet: https://atta.szlcsc.com/upload/public/pdf/source/20211221/925EC7D7225764EE0046F22065062C87.pdf; Supplier: LCSC; Type: 厚膜电阻; Tolerance: ±5%; Power(Watts): 100mW; Overload Voltage (Max): 75V; Temperature Coefficient: ±100ppm/℃; Operating Temperature Range: -55℃~+155℃
R12 R13 R20 R21 R23-R27 R55 R57 R58 R65 = 0603WAF1001T5E: 电阻类型:厚膜电阻;阻值:1kΩ;精度:±1%;功率:100mW;最大工作电压:75V;温度系数:±100ppm/℃;; LCSC Part Name: 1kΩ ±1% 100mW 厚膜电阻; Supplier Part: C21190; Manufacturer: UNI-ROYAL(厚声); Supplier Footprint: 0603; JLCPCB Part Class: Basic Part; Datasheet: https://atta.szlcsc.com/upload/public/pdf/source/20200306/C422600_1E6D84923E4A46A82E41ADD87F860B5C.pdf; Supplier: LCSC; Type: 厚膜电阻; Tolerance: ±1%; Power(Watts): 100mW; Overload Voltage (Max): 75V; Temperature Coefficient: ±100ppm/℃; Operating Temperature Range: -55℃~+155℃
R14 = 0603WAF7500T5E: 电阻类型:厚膜电阻;阻值:750Ω;精度:±1%;功率:100mW;最大工作电压:75V;温度系数:±100ppm/℃;; LCSC Part Name: 750Ω ±1% 100mW 厚膜电阻; Supplier Part: C23241; Manufacturer: UNI-ROYAL(厚声); Supplier Footprint: 0603; JLCPCB Part Class: 扩展库; Datasheet: https://atta.szlcsc.com/upload/public/pdf/source/20200306/C422600_1E6D84923E4A46A82E41ADD87F860B5C.pdf; Supplier: LCSC; Type: 厚膜电阻; Tolerance: ±1%; Power(Watts): 100mW; Overload Voltage (Max): 75V; Temperature Coefficient: ±100ppm/℃; Operating Temperature Range: -55℃~+155℃
R15 R60-R62 = 0603WAF1003T5E: 电阻类型:厚膜电阻;阻值:100kΩ;精度:±1%;功率:100mW;最大工作电压:75V;温度系数:±100ppm/℃;; LCSC Part Name: 100kΩ ±1% 100mW 厚膜电阻; Supplier Part: C25803; Manufacturer: UNI-ROYAL(厚声); Supplier Footprint: 0603; JLCPCB Part Class: Basic Part; Datasheet: https://atta.szlcsc.com/upload/public/pdf/source/20200306/C422600_1E6D84923E4A46A82E41ADD87F860B5C.pdf; Supplier: LCSC; Type: 厚膜电阻; Tolerance: ±1%; Power(Watts): 100mW; Overload Voltage (Max): 75V; Temperature Coefficient: ±100ppm/℃; Operating Temperature Range: -55℃~+155℃
R16 = 0603WAF1000T5E: 电阻类型:厚膜电阻;阻值:100Ω;精度:±1%;功率:100mW;最大工作电压:75V;温度系数:±200ppm/℃;; LCSC Part Name: 100Ω ±1% 100mW 厚膜电阻; Supplier Part: C22775; Manufacturer: UNI-ROYAL(厚声); Supplier Footprint: 0603; JLCPCB Part Class: 基础库; Datasheet: https://atta.szlcsc.com/upload/public/pdf/source/20200306/C422600_1E6D84923E4A46A82E41ADD87F860B5C.pdf; Supplier: LCSC; Type: 厚膜电阻; Tolerance: ±1%; Power(Watts): 100mW; Overload Voltage (Max): 75V; Temperature Coefficient: ±200ppm/℃; Operating Temperature Range: -55℃~+155℃
R18 R19 R28 R33 R34 = 1206W4F0000T5E: 电阻类型:厚膜电阻;阻值:0Ω;精度:±1%;功率:250mW;最大工作电压:200V;温度系数:±800ppm/℃;; LCSC Part Name: 0Ω ±1% 250mW 厚膜电阻; Supplier Part: C17888; Manufacturer: UNI-ROYAL(厚声); Supplier Footprint: 1206; JLCPCB Part Class: 基础库; Datasheet: https://atta.szlcsc.com/upload/public/pdf/source/20200306/C422600_1E6D84923E4A46A82E41ADD87F860B5C.pdf; Supplier: LCSC; Type: 厚膜电阻; Tolerance: ±1%; Power(Watts): 250mW; Overload Voltage (Max): 200V; Temperature Coefficient: ±800ppm/℃; Operating Temperature Range: -55℃~+155℃
U1 = TPS55340PWPR: 功能类型:升压型;输出类型:固定;工作电压:2.9V~32V;输出电压:24V;输出电流:5.25A;; LCSC Part Name: 5-A, 40-V 非同步开关调节器; Supplier Part: C43862; Manufacturer: TI(德州仪器); Supplier Footprint: HTSSOP-14-EP; JLCPCB Part Class: 扩展库; Datasheet: https://www.ti.com/cn/lit/gpn/tps55340; Supplier: LCSC; Function: 升压型; Output Type: 固定; Input Voltage: 2.9V~32V; Output Voltage: 24V; Output Current: 5.25A; Switching Frequency: 100kHz~1.2MHz; Operating Temperature: -40℃~+150℃; Synchronous Rectification: 否; Number of Outputs: 1; Topology: 升压式；SEPIC；反激式; Switch tube (built-in/external): 内置
U4 = TPS5450DDAR: 功能类型:降压型;输出类型:可调;输入电压:5.5V~36V;输出电压:1.221V~31.32V;输出电流(最大值):5A;; Supplier Part: C114425; Manufacturer: TI(德州仪器); Supplier Footprint: SOP-8-EP-150mil; JLCPCB Part Class: Extended Part; Datasheet: https://www.ti.com/cn/lit/gpn/tps5450; Supplier: LCSC; Function: 降压型; Output Type: 可调; Input Voltage: 5.5V~36V; Output Voltage: 1.221V~31.32V; Output Current (Max): 5A; Switching Frequency: 500kHz; Operating Temperature: -40℃~+125℃@(TJ); Synchronous Rectification: 否; Number of Outputs: 1; Topology: 降压式; Switch tube (built-in/external): 内置
U5 = LM358G-S08-R: 放大器数:双路;; Supplier Part: C71101; Manufacturer: UTC(友顺); Supplier Footprint: SOIC-8; JLCPCB Part Class: Extended Part; Datasheet: https://atta.szlcsc.com/upload/public/pdf/source/20160416/1460799393349.pdf; Supplier: LCSC; Number of Circuits: 双路; Quiescent Current: 2mA
C54 C55 = CL21A225KBQNNNE: 容值:2.2uF;精度:±10%;额定电压:50V;材质(温度系数):X5R;; LCSC Part Name: 2.2uF ±10% 50V; Supplier Part: C377773; Manufacturer: SAMSUNG(三星); Supplier Footprint: 0805; JLCPCB Part Class: Basic Part; Datasheet: https://atta.szlcsc.com/upload/public/pdf/source/20160218/1457707763339.pdf; Supplier: LCSC; Tolerance: ±10%; Voltage Rated: 50V; Temperature Coefficient: X5R
C60 C61 = 0805B471K500NT: 容值:470pF;精度:±10%;额定电压:50V;温度系数:X7R;; LCSC Part Name: 470pF ±10% 50V; Supplier Part: C1743; Manufacturer: FH(风华); Supplier Footprint: 0805; JLCPCB Part Class: 基础库; Datasheet: https://atta.szlcsc.com/upload/public/pdf/source/20200305/C486355_26A10D38EF8C2A5C37091D0039909270.pdf; Supplier: LCSC; Tolerance: ±10%; Voltage Rating: 50V; Temperature Coefficient: X7R
CN1 = PJ-342_C668606: 连接器类型:3.5mm耳机座;额定电流:500mA;额定电压:30V;工作温度范围:-30℃~+70℃;; LCSC Part Name: 3.5mm耳机座; Supplier Part: C668606; Manufacturer: SHOU HAN(首韩); Supplier Footprint: SMD; JLCPCB Part Class: 扩展库; Datasheet: https://atta.szlcsc.com/upload/public/pdf/source/20200618/C668606_D9051A7D9D1D8CCDEAA76A8E7BC279ED.pdf; Supplier: LCSC; Connector Type: 3.5mm耳机座; Current Rating (Max): 500mA; Voltage Rating (Max): 30V; Operating Temperature Range: -30℃~+70℃
R42 R43 R45 R46 = 0603WAF4701T5E: 电阻类型:厚膜电阻;阻值:4.7kΩ;精度:±1%;功率:100mW;最大工作电压:75V;温度系数:±100ppm/℃;; LCSC Part Name: 4.7kΩ ±1% 100mW 厚膜电阻; Supplier Part: C23162; Manufacturer: UNI-ROYAL(厚声); Supplier Footprint: 0603; JLCPCB Part Class: 基础库; Datasheet: https://atta.szlcsc.com/upload/public/pdf/source/20200306/C422600_1E6D84923E4A46A82E41ADD87F860B5C.pdf; Supplier: LCSC; Type: 厚膜电阻; Tolerance: ±1%; Power(Watts): 100mW; Overload Voltage (Max): 75V; Temperature Coefficient: ±100ppm/℃; Operating Temperature Range: -55℃~+155℃
R44 R49 R54 = B10K
R50-R53 R56 = 0603WAF1002T5E: 电阻类型:厚膜电阻;阻值:10kΩ;精度:±1%;功率:100mW;最大工作电压:75V;温度系数:±100ppm/℃;; LCSC Part Name: 厚膜电阻 10kΩ ±1% 100mW; Supplier Part: C25804; Manufacturer: UNI-ROYAL(厚声); Supplier Footprint: 0603; JLCPCB Part Class: 基础库; Datasheet: https://atta.szlcsc.com/upload/public/pdf/source/20200306/C422600_1E6D84923E4A46A82E41ADD87F860B5C.pdf; Supplier: LCSC; Type: 厚膜电阻; Tolerance: ±1%; Power(Watts): 100mW; Overload Voltage (Max): 75V; Temperature Coefficient: ±100ppm/℃; Operating Temperature Range: -55℃~+155℃
C21 C30 = KNH4100UF50V149EC0024: 容值:100uF;精度:±20%;额定电压:50V;纹波电流:-;等效串联电阻(ESR):-;类型:-;; LCSC Part Name: 100uF ±20% 50V; Supplier Part: C2927900; Manufacturer: KNSCHA(科尼盛); Supplier Footprint: 插件,D8xL12mm; JLCPCB Part Class: Extended Part; Datasheet: https://atta.szlcsc.com/upload/public/pdf/source/20220426/FBA31D3684889FAFEB49FEEB0664C4A4.pdf; Supplier: LCSC; Tolerance: ±20%; Voltage Rating: 50V; Diameter: 8mm; Height - Seated (Max): 12mm; Operating Temperature: -55℃~+125℃
C23 C32 = CC0603KRX7R9BB102: 容值:1nF;精度:±10%;额定电压:50V;材质(温度系数):X7R;; LCSC Part Name: 1nF ±10% 50V; Supplier Part: C100040; Manufacturer: YAGEO(国巨); Supplier Footprint: 0603; JLCPCB Part Class: Extended Part; Datasheet: https://atta.szlcsc.com/upload/public/pdf/source/20180910/C282072_33301C7F631E79921B82A8DAC6BCC5B3.pdf; Supplier: LCSC; Tolerance: ±10%; Voltage Rated: 50V; Temperature Coefficient: X7R
C14 C24 C26 C40 C41 = CC0603KRX7R9BB474: 容值:470nF;精度:±10%;额定电压:50V;材质(温度系数):X7R;; LCSC Part Name: 470nF ±10% 50V; Supplier Part: C513577; Manufacturer: YAGEO(国巨); Supplier Footprint: 0603; JLCPCB Part Class: 扩展库; Datasheet: https://atta.szlcsc.com/upload/public/pdf/source/20200423/C519417_FF9998E3F66D767819CD86A66B468321.pdf; Supplier: LCSC; Tolerance: ±10%; Voltage Rated: 50V; Temperature Coefficient: X7R
C25 C28 C29 = CL10A105KB8NNNC: 容值:1uF;精度:±10%;额定电压:50V;材质(温度系数):X5R;; LCSC Part Name: 1uF ±10% 50V; Supplier Part: C15849; Manufacturer: SAMSUNG(三星); Supplier Footprint: 0603; JLCPCB Part Class: Basic Part; Datasheet: https://atta.szlcsc.com/upload/public/pdf/source/20160218/1457707763339.pdf; Supplier: LCSC; Tolerance: ±10%; Voltage Rated: 50V; Temperature Coefficient: X5R
C33 C34 = CGA0603X5R105K500JT: 容值:1uF;精度:±10%;额定电压:50V;材质(温度系数):X5R;; LCSC Part Name: 1uF ±10% 50V; Supplier Part: C6119852; Manufacturer: HRE(芯声); Supplier Footprint: 0603; JLCPCB Part Class: Extended Part; Supplier: LCSC; Tolerance: ±10%; Voltage Rated: 50V; Temperature Coefficient: X5R
H2 H5 = PZ254V-11-04P: 插针结构:1x4P;间距:2.54mm;行距:-;圆针/方针:方针;安装类型:直插;排数:单排;总PIN位数:4P;额定电流:3A;额定电压:250V;配合针长度:6mm;塑高:2.5mm;端接针长度:3mm;触头材质:-;工作温度范围:-40℃~+105℃;颜色:黑色;; LCSC Part Name: 间距:2.54mm 1x4P 直插 方针; Supplier Part: C2691448; Manufacturer: XFCN(兴飞); Supplier Footprint: 插件,P=2.54mm; JLCPCB Part Class: Extended Part; Datasheet: https://atta.szlcsc.com/upload/public/pdf/source/20200309/C492403_F9F19131791D08044AD4F84F8E751A34.pdf; Supplier: LCSC; Pin Structure: 1x4P; Pitch: 2.54mm; Circluar Pins/Square Pins: 方针; Mounting Type: 直插; Number of Rows: 单排; Number of Pins: 4P; Current Rating (Max): 3A; Voltage Rating (Max): 250V; Length of Mating Pin: 6mm; Insulation Height: 2.5mm; Length of End Connection Pin: 3mm; Operating Temperature Range: -40℃~+105℃; Color: 黑色
L3 L4 = FXL1040-150-M: 电感值:15uH;精度:±20%;额定电流:6.5A;饱和电流(Isat):7A;类型:一体成型电感;; LCSC Part Name: 15uH ±20% 7A; Supplier Part: C475916; Manufacturer: cjiang(长江微电); Supplier Footprint: SMD,11.5x10mm; JLCPCB Part Class: Extended Part; Datasheet: https://atta.szlcsc.com/upload/public/pdf/source/20240426/3189EA8206330E2108542F9E34E540E7.pdf; Supplier: LCSC; Tolerance: ±20%; Rated Current: 6.5A; Saturation Current (Isat): 7A; DC Resistance (DCR): 45mΩ; Type: 一体成型电感
LED1 LED4 = XL-1608UGC-04: 灯头类型:-;发光颜色:翠绿色;正向电压(VF):-;功率:80mW;正向电流:25mA;主波长:516nm~525nm;二极管配置:独立二极管;透镜颜色:无色透明透镜;色温:-;发光强度:-;发光角度:120°;载带方式:正贴;工作温度:-30℃~+85℃;; Supplier Part: C965804; Manufacturer: XINGLIGHT(成兴光); Supplier Footprint: 0603; JLCPCB Part Class: 扩展库; Datasheet: https://atta.szlcsc.com/upload/public/pdf/source/20221102/520D6E465E5CFD1609C8A4DBC80D4018.pdf; Supplier: LCSC; Emitted Color: 翠绿色; Power Dissipation: 80mW; Forward Current: 25mA; Dominant Wavelength: 516nm~525nm; Peak Wavelength: 534nm; Diode Configuration: 独立二极管; Lens Color: 无色透明透镜; Viewing Angle: 120°; Mounting Sytle: 正贴; Operating Temperature: -30℃~+85℃
R10 = FRC1206J100 TS: 电阻类型:厚膜电阻;阻值:10Ω;精度:±5%;功率:250mW;最大工作电压:200V;温度系数:±100ppm/℃;; LCSC Part Name: 10Ω ±5% 250mW 厚膜电阻; Supplier Part: C2907424; Manufacturer: FOJAN(富捷); Supplier Footprint: 1206; JLCPCB Part Class: Extended Part; Datasheet: https://atta.szlcsc.com/upload/public/pdf/source/20211221/925EC7D7225764EE0046F22065062C87.pdf; Supplier: LCSC; Type: 厚膜电阻; Tolerance: ±5%; Power(Watts): 250mW; Overload Voltage (Max): 200V; Temperature Coefficient: ±100ppm/℃; Operating Temperature Range: -55℃~+155℃
U3 = TPA3110D2PWPR: 功放类型:D类功放;扬声器通道数:双声道;输出功率:15Wx2@8Ω;; LCSC Part Name: 15W立体声D类音频功率放大器; Supplier Part: C30132; Manufacturer: TI(德州仪器); Supplier Footprint: HTSSOP-28-EP; JLCPCB Part Class: 扩展库; Datasheet: https://www.ti.com/cn/lit/gpn/tpa3110d2; Supplier: LCSC; Type of Power Amplifier: D类功放; Speaker Channels: 双声道; Output Power: 15Wx2@8Ω; Supply Voltage: 8V~26V
U6 = NE5532DR: 放大器数:双路;增益带宽积(GBP):10MHz;输入偏置电流(Ib):200nA;压摆率(SR):9V/us;带宽(-3db):-;; Supplier Part: C7426; Manufacturer: TI(德州仪器); Supplier Footprint: SOIC-8; JLCPCB Part Class: 基础库; Datasheet: http://www.ti.com/cn/lit/gpn/ne5532; Supplier: LCSC; Number of Circuits: 双路; Gain Bandwidth Product(GBP): 10MHz; Current - Input Bias(Ib): 200nA; Slew Rate(SR): 9V/us; Output Current: 38mA; Supply Current: 8mA; Operating Temperature: 0℃~+70℃
C15 C70-C73 = CL31A226KOHNNNE: 容值:22uF;精度:±10%;额定电压:16V;材质(温度系数):X5R;; LCSC Part Name: 22uF ±10% 16V; Supplier Part: C90146; Manufacturer: SAMSUNG(三星); Supplier Footprint: 1206; JLCPCB Part Class: Extended Part; Datasheet: https://atta.szlcsc.com/upload/public/pdf/source/20161228/1482890861309.pdf; Supplier: LCSC; Tolerance: ±10%; Voltage Rated: 16V; Temperature Coefficient: X5R
H6 = PZ254V-11-03P: 插针结构:1x3P;间距:2.54mm;行距:-;圆针/方针:方针;安装方式:直插;排数:单排;总PIN位数:3P;额定电流:3A;额定电压:250V;配合针长度:6mm;塑高:2.5mm;端接针长度:3mm;工作温度:-40℃~+105℃;颜色:黑色;; LCSC Part Name: 1x3P 间距:2.54mm 方针 直插; Supplier Part: C2937625; Manufacturer: XFCN(兴飞); Supplier Footprint: 插件,P=2.54mm; JLCPCB Part Class: Extended Part; Datasheet: https://atta.szlcsc.com/upload/public/pdf/source/20200309/C492402_8335C3D49C4E4C618838D59BB1D024C1.pdf; Supplier: LCSC; Pin Structure: 1x3P; Pitch: 2.54mm; Circluar Pins/Square Pins: 方针; Mounting Type: 直插; Number of Rows: 单排; Number of Pins: 3P; Current Rating: 3A; Voltage Rating (Max): 250V; Length of Mating Pin: 6mm; Insulation Height: 2.5mm; Length of End Connection Pin: 3mm; Operating Temperature: -40℃~+105℃; Color: 黑色; Current Rating (Max): 3A; Operating Temperature Range: -40℃~+105℃
L7 = FXL0630-150-M: 电感值:15uH;精度:±20%;额定电流:3A;饱和电流(Isat):4.5A;类型:一体成型电感;; LCSC Part Name: 15uH ±20% 4.5A; Supplier Part: C177243; Manufacturer: cjiang(长江微电); Supplier Footprint: SMD,6.6x7mm; JLCPCB Part Class: Extended Part; Datasheet: https://atta.szlcsc.com/upload/public/pdf/source/20240426/3189EA8206330E2108542F9E34E540E7.pdf; Supplier: LCSC; Tolerance: ±20%; Rated Current: 3A; Saturation Current (Isat): 4.5A; DC Resistance (DCR): 115mΩ; Type: 一体成型电感
L8 = FNR3015S2R2MT: 电感值:2.2uH;精度:±20%;额定电流:2A;饱和电流(Isat):2A;; LCSC Part Name: 2.2uH ±20% 2A; Supplier Part: C167747; Manufacturer: cjiang(长江微电); Supplier Footprint: SMD,3x3mm; JLCPCB Part Class: Extended Part; Datasheet: https://atta.szlcsc.com/upload/public/pdf/source/20190327/C167925_9EFF0AABC4CA629C2CC95961DBF7D39D.pdf; Supplier: LCSC; Tolerance: ±20%; Rated Current: 2A; Saturation Current (Isat): 2A; DC Resistance (DCR): 78mΩ
R63 = FRC0603F1302TS: 电阻类型:厚膜电阻;阻值:13kΩ;精度:±1%;功率:100mW;最大工作电压:75V;温度系数:±100ppm/℃;; LCSC Part Name: 13kΩ ±1% 100mW 厚膜电阻; Supplier Part: C2906992; Manufacturer: FOJAN(富捷); Supplier Footprint: 0603; JLCPCB Part Class: Extended Part; Datasheet: https://atta.szlcsc.com/upload/public/pdf/source/20211221/925EC7D7225764EE0046F22065062C87.pdf; Supplier: LCSC; Type: 厚膜电阻; Tolerance: ±1%; Power(Watts): 100mW; Overload Voltage (Max): 75V; Temperature Coefficient: ±100ppm/℃; Operating Temperature Range: -55℃~+155℃
R64 = FRC0402F4503TS: 电阻类型:厚膜电阻;阻值:450kΩ;精度:±1%;功率:62.5mW;最大工作电压:50V;温度系数:±100ppm/℃;; LCSC Part Name: 450kΩ ±1% 62.5mW 厚膜电阻; Supplier Part: C5159688; Manufacturer: FOJAN(富捷); Supplier Footprint: 0402; JLCPCB Part Class: Extended Part; Datasheet: https://atta.szlcsc.com/upload/public/pdf/source/20211221/925EC7D7225764EE0046F22065062C87.pdf; Supplier: LCSC; Type: 厚膜电阻; Tolerance: ±1%; Power(Watts): 62.5mW; Overload Voltage (Max): 50V; Temperature Coefficient: ±100ppm/℃
U7 U13 U14 = TPS54302DDCR: 功能类型:降压型;输出类型:固定;工作电压:4.5V~28V;输出电压:5V;输出电流:3A;; LCSC Part Name: 4.5V至28V输入、3A输出、EMI友好的同步降压转换器; Supplier Part: C311983; Manufacturer: TI(德州仪器); Supplier Footprint: TSOT-23-6; JLCPCB Part Class: 扩展库; Datasheet: https://www.ti.com/cn/lit/gpn/tps54302; Supplier: LCSC; Function: 降压型; Output Type: 固定; Input Voltage: 4.5V~28V; Output Voltage: 5V; Output Current: 3A; Switching Frequency: 400kHz; Operating Temperature: -40℃~+125℃; Synchronous Rectification: 是; Number of Outputs: 1; Topology: 降压式; Quiescent Current (Iq): 45uA; Switch tube (built-in/external): 内置
U15 = TLV62568DBVR: 功能类型:降压型;输出类型:可调;工作电压:2.5V~5.5V;输出电压:600mV~5.5V;输出电流:1A;; LCSC Part Name: 1A高效同步降压转换器; Supplier Part: C163219; Manufacturer: TI(德州仪器); Supplier Footprint: SOT-23-5; JLCPCB Part Class: 扩展库; Datasheet: https://www.ti.com/cn/lit/gpn/tlv62568; Supplier: LCSC; Function: 降压型; Output Type: 可调; Input Voltage: 2.5V~5.5V; Output Voltage: 600mV~5.5V; Output Current: 1A; Switching Frequency: 1.5MHz; Operating Temperature: -40℃~+125℃@(TJ); Synchronous Rectification: 是; Number of Outputs: 1; Topology: 降压式; Switch tube (built-in/external): 内置
D6 = 1N4007W_C18199088: 二极管配置:独立式;正向压降(Vf):1V@1.0A;直流反向耐压(Vr):1kV;整流电流:1A;; Supplier Part: C18199088; Manufacturer: 宏迦橙; Supplier Footprint: SOD-123FL; JLCPCB Part Class: 扩展库; Datasheet: https://atta.szlcsc.com/upload/public/pdf/source/20230925/B0AB2B510D392D7083D021E804ED238F.pdf; Supplier: LCSC; Diode Configuration: 独立式; Forward Voltage (Vf@If): 1V@1.0A; Reverse Voltage (Vr): 1kV; Rectified Current: 1A; Reverse Leakage Current (Ir): 2uA@1000V
LED11-LED20 = XL-1608SURC-06: 发光颜色:红色;功率:55mW;正向电流:25mA;主波长:617nm~621nm;透镜颜色:无色透明透镜;色温:-;发光角度:120°;载带方式:正贴;工作温度:-30℃~+85℃;; Supplier Part: C965799; Manufacturer: XINGLIGHT(成兴光); Supplier Footprint: 0603; JLCPCB Part Class: 扩展库; Datasheet: https://atta.szlcsc.com/upload/public/pdf/source/20221102/D860AFDD1CDB02C5A8064103A32707E2.pdf; Supplier: LCSC; Emitted Color: 红色; Power Dissipation: 55mW; Forward Current: 25mA; Dominant Wavelength: 617nm~621nm; Peak Wavelength: 623nm; Lens Color: 无色透明透镜; Viewing Angle: 120°; Mounting Sytle: 正贴; Operating Temperature: -30℃~+85℃
R59 = 3362P-1-103: 阻值:10kΩ;精度:±10%;; LCSC Part Name: 10kΩ ±10%; Supplier Part: C118956; Manufacturer: BOCHEN(博晨); Supplier Footprint: 插件; JLCPCB Part Class: 扩展库; Datasheet: https://atta.szlcsc.com/upload/public/pdf/source/20171114/C118956_15106326650691117445.pdf; Supplier: LCSC; Tolerance: ±10%
U11 = LM3916N: Supplier Part: C3188557; Manufacturer: TI(德州仪器); Supplier Footprint: DIP-18; JLCPCB Part Class: Extended Part; Datasheet: https://atta.szlcsc.com/upload/public/pdf/source/20230922/2DBD82BF0DAD1A0C92DD3A1FE58C0281.pdf; Supplier: LCSC
U12 = NE5532M/TR: 放大器数:双路;轨到轨:-;增益带宽积(GBP):10MHz;输入失调电压(Vos):5mV;压摆率(SR):11V/us;; Supplier Part: C434481; Manufacturer: HGSEMI(华冠); Supplier Footprint: SOP-8; JLCPCB Part Class: 扩展库; Datasheet: https://atta.szlcsc.com/upload/public/pdf/source/20210809/66312FEEAFFA9061399869F04D2CC1E4.pdf; Supplier: LCSC; Number of Circuits: 双路; Gain Bandwidth Product(GBP): 10MHz; Voltage - Input Offset(Vos): 5mV; Slew Rate(SR): 11V/us; Noise density(eN): 8nV/√Hz@1kHz; Common Mode Rejection Ratio (CMRR): 100dB; Operating Temperature: 0℃~+70℃
C38 = ERS1HM101F12OT: 容值:100uF;精度:±20%;额定电压:50V;; LCSC Part Name: 100uF ±20% 50V; Supplier Part: C112510; Manufacturer: AISHI(艾华集团); Supplier Footprint: 插件,D8xL12mm; JLCPCB Part Class: 扩展库; Datasheet: https://atta.szlcsc.com/upload/public/pdf/source/20191015/C438940_4B8E60A742BB0AE40DDEF87A5C89089D.pdf; Supplier: LCSC; Tolerance: ±20%; Rated Voltage: 50V; Lead Spacing: 3.5mm; φD: 8mm; L: 12mm; Lifetime @ Temp: 7000hrs@105℃
C42 C49 = RVT10UF16V67RV0012: 容值:10uF;精度:±20%;额定电压:16V;纹波电流:17mA@120Hz;; LCSC Part Name: 10uF ±20% 16V; Supplier Part: C2895275; Manufacturer: KNSCHA(科尼盛); Supplier Footprint: SMD,D4xL5.4mm; JLCPCB Part Class: 扩展库; Datasheet: https://atta.szlcsc.com/upload/public/pdf/source/20210913/7C7FF837D47D33EAC77F0CE6D659CCC4.pdf; Supplier: LCSC; Tolerance: ±20%; Rated Voltage: 16V; Ripple Current: 17mA@120Hz; φD: 4mm; L: 5.4mm; Lifetime @ Temp: 2000hrs@105℃; Operating Temperature: -55℃~+105℃
C44 C45 C47 = HGC1206R5106K500NSPJ: 容值:10uF;精度:±10%;额定电压:50V;材质(温度系数):X5R;; LCSC Part Name: 10uF ±10% 50V; Supplier Part: C7432781; Manufacturer: Chinocera(华瓷); Supplier Footprint: 1206; JLCPCB Part Class: Extended Part; Datasheet: https://atta.szlcsc.com/upload/public/pdf/source/20240320/FAC3FEC40A78BC5CCCE96C232A94D860.pdf; Supplier: LCSC; Tolerance: ±10%; Voltage Rated: 50V; Temperature Coefficient: X5R
D5 = 1N5819WS_C191023: 正向压降(Vf):600mV@1A;直流反向耐压(Vr):40V;整流电流:1A;; LCSC Part Name: 电压:40V 电流:1A; Supplier Part: C191023; Manufacturer: Hottech(合科泰); Supplier Footprint: SOD-323; JLCPCB Part Class: Basic Part; Datasheet: https://atta.szlcsc.com/upload/public/pdf/source/20220428/3CB86FD8D28D653594B4E35F9D5AEFD9.pdf; Supplier: LCSC; Forward Voltage (Vf@If): 600mV@1A; Reverse Voltage (Vr): 40V; Rectified Current: 1A
H7 = PZ254V-11-03P: 插针结构:1x3P;间距:2.54mm;行距:-;圆针/方针:方针;安装方式:直插;排数:单排;总PIN位数:3P;额定电流:3A;额定电压:250V;配合针长度:6mm;塑高:2.5mm;端接针长度:3mm;工作温度:-40℃~+105℃;颜色:黑色;; LCSC Part Name: 1x3P 间距:2.54mm 方针 直插; Supplier Part: C2937625; Manufacturer: XFCN(兴飞); Supplier Footprint: 插件,P=2.54mm; JLCPCB Part Class: Extended Part; Datasheet: https://atta.szlcsc.com/upload/public/pdf/source/20200309/C492402_8335C3D49C4E4C618838D59BB1D024C1.pdf; Supplier: LCSC; Pin Structure: 1x3P; Pitch: 2.54mm; Circluar Pins/Square Pins: 方针; Mounting Type: 直插; Number of Rows: 单排; Number of Pins: 3P; Current Rating: 3A; Voltage Rating (Max): 250V; Length of Mating Pin: 6mm; Insulation Height: 2.5mm; Length of End Connection Pin: 3mm; Operating Temperature: -40℃~+105℃; Color: 黑色
L5 = SMMS0650-220M: 电感值:22uH;精度:±20%;额定电流:2.5A;饱和电流(Isat):4A;类型:一体成型电感;; LCSC Part Name: 22uH ±20% 4A; Supplier Part: C149586; Manufacturer: SXN(顺翔诺); Supplier Footprint: SMD,6.6x7.1mm; JLCPCB Part Class: Extended Part; Datasheet: https://atta.szlcsc.com/upload/public/pdf/source/20210810/BBF24330FB2F5029F637830BA9C42C0D.pdf; Supplier: LCSC; Tolerance: ±20%; Rated Current: 2.5A; Saturation Current (Isat): 4A; DC Resistance (DCR): 140mΩ; Type: 一体成型电感
L6 = BLM18AG601SN1D: 标称阻抗@测试频率:600Ω@100MHz;误差:±25%;直流电阻(RDC):380mΩ;; LCSC Part Name: 单路 0603磁珠 阻抗600Ω@100MHz; Supplier Part: C19330; Manufacturer: muRata(村田); Supplier Footprint: 0603; JLCPCB Part Class: 扩展库; Datasheet: https://atta.szlcsc.com/upload/public/pdf/source/20180329/C160981_FD3C2D2622A377E203B89F4AA32B0741.pdf; Supplier: LCSC; Impedance @ Frequency: 600Ω@100MHz; Tolerance: ±25%; DC Resistance: 380mΩ; Current Rating: 500mA; Circuits: 1
LED3 = XL-1608SURC-06: 发光颜色:红色;功率:55mW;正向电流:25mA;主波长:617nm~621nm;透镜颜色:无色透明透镜;色温:-;发光角度:120°;载带方式:正贴;工作温度:-30℃~+85℃;; Supplier Part: C965799; Manufacturer: XINGLIGHT(成兴光); Supplier Footprint: 0603; JLCPCB Part Class: 扩展库; Datasheet: https://atta.szlcsc.com/upload/public/pdf/source/20221102/D860AFDD1CDB02C5A8064103A32707E2.pdf; Supplier: LCSC; Emitted Color: 红色; Power Dissipation: 55mW; Forward Current: 25mA; Dominant Wavelength: 617nm~621nm; Peak Wavelength: 623nm; Lens Color: 无色透明透镜; Viewing Angle: 120°; Mounting Sytle: 正贴; Operating Temperature: -30℃~+85℃; Illumination Color: 红色; Voltage - Forward(Vf): 2.3V; Power(Watts): 50mW; Wavelength - Dominant: 620nm~630nm; Luminous Intensity: 225mcd
R9 R30 = FRC0603J151 TS: 电阻类型:厚膜电阻;阻值:150Ω;精度:±5%;功率:100mW;工作电压:75V;温度系数:±100ppm/℃;; LCSC Part Name: 150Ω ±5% 100mW 厚膜电阻; Supplier Part: C2907103; Manufacturer: FOJAN(富捷); Supplier Footprint: 0603; JLCPCB Part Class: Extended Part; Datasheet: https://atta.szlcsc.com/upload/public/pdf/source/20211221/925EC7D7225764EE0046F22065062C87.pdf; Supplier: LCSC; Type: 厚膜电阻; Tolerance: ±5%; Power(Watts): 100mW; Voltage-Supply(Max): 75V; Temperature Coefficient: ±100ppm/℃; Operating Temperature: -55℃~+155℃
R32 = FRC0603F7500TS: 电阻类型:厚膜电阻;阻值:750Ω;精度:±1%;功率:100mW;工作电压:75V;温度系数:±100ppm/℃;; LCSC Part Name: 750Ω ±1% 100mW 厚膜电阻; Supplier Part: C2907066; Manufacturer: FOJAN(富捷); Supplier Footprint: 0603; JLCPCB Part Class: 扩展库; Datasheet: https://atta.szlcsc.com/upload/public/pdf/source/20211221/925EC7D7225764EE0046F22065062C87.pdf; Supplier: LCSC; Type: 厚膜电阻; Tolerance: ±1%; Power(Watts): 100mW; Voltage-Supply(Max): 75V; Temperature Coefficient: ±100ppm/℃; Operating Temperature: -55℃~+155℃
U8 = LM7805S/TR: 输出类型:-;; LCSC Part Name: 固定电压稳压器; Supplier Part: C507146; Manufacturer: HGSEMI(华冠); Supplier Footprint: TO-263-3; JLCPCB Part Class: 扩展库; Datasheet: https://atta.szlcsc.com/upload/public/pdf/source/20211101/54C90BF39C07253AC431AF453924CB99.pdf; Supplier: LCSC
U9 = ICL7660M/TR: Supplier Part: C356724; Manufacturer: HGSEMI(华冠); Supplier Footprint: SOP-8; JLCPCB Part Class: 扩展库; Datasheet: https://atta.szlcsc.com/upload/public/pdf/source/20220223/B7DC69E53F1DD57A8AF8717E7604F527.pdf; Supplier: LCSC
U10 = LM7905S/TR: 输出电压:5V;; Supplier Part: C2926297; Manufacturer: HGSEMI(华冠); Supplier Footprint: TO-263-3; JLCPCB Part Class: 扩展库; Datasheet: https://atta.szlcsc.com/upload/public/pdf/source/20220921/D54579C407B8098A57F5285C42DC4416.pdf; Supplier: LCSC; Output Voltage: 5V; Feature: 热保护(TSD)

## Nets
+3.3V: C67.2 C70.1 H6.1 L8.2 R62.1
+5V_A: C15.1 C62.2 C69.2 C72.1 C73.1 H5.1 L7.2 Q1.3(C) Q4.3(D) R61.2 U14.3(VIN)
+5V_B: C41.2 C42.1 R30.1 R33.1 U6.8(VCC+) U8.3(OUT)
+8.5V: C35.2 C38.1 C40.2 L5.2 R31.2 U8.1(VCC) U9.8(V+)
+18V: C21.1 C22.1 C23.1 C30.1 C31.1 C32.1 H2.3 K1.5 LED11.2(A) LED12.2(A) LED13.2(A) LED14.2(A) LED15.2(A) LED16.2(A) LED17.2(A) LED18.2(A) LED19.2(A) LED20.2(A) R10.1 R22.1 R60.1 U3.15(PVCCR) U3.16(PVCCR) U3.27(PVCCL) U3.28(PVCCL) U11.3(V+) U11.9(MODESELECT)
+18V_1: C5.2 C6.2 C7.2 C8.2 D1.2(K) K1.2 R2.2
+18V_2: C10.1 C18.1 C19.2 K1.3 L2.2 R11.2 U5.3(+IN)
+24V: C12.2 C16.2 C20.2 U4.7(VIN)
-5V: C14.1 C49.2 R9.1 R34.1 U6.4(VCC-/GND) U10.3(OUTPUT) U12.4(VCC-)
-8.5V: C44.1 C45.2 D5.2(A) U10.2(INPUT)
AGND: C14.2 C33.1 C34.2 C41.1 C42.2 C49.1 C60.2 C61.1 CN1.2 CN1.3 H7.1 L6.1 LED3.1(K) LED4.2(A) R23.1 R33.2 R34.2 R42.2 R43.2 R44.1 R44.4 R50.2 R51.2 R54.1 R54.4 R55.1 U6.5(IN2+) U8.2(GND) U8.4(GND) U10.1(GND) U12.8(VCC+)
AGND_1: C9.2 R1.2 R3.2 R14.2 R18.2 R19.2 U1.7(AGND) U1.15(EP)
AGND_2: C25.1 R28.2 U3.3(LINP) U3.4(LINN) U3.8(AGND)
GND: D4.2(A) K1.1 Q2.2(E) R17.2 U5.2(-IN) U5.4(V-)
VIN2: C37.2 C47.2 H7.3 U7.3(VIN)
BAT+: C2.2 C3.1 C4.2 C64.2 C71.1 H5.3 L1.1 U1.3(VIN) U13.3(VIN)
BAT-: Q5.3(S)
CRL1: R12.1 R13.1
CRL2: R15.1
DIVIDER_L: R59.2 R59.3 R60.2 U11.6(DIVIDER)
EN1: H5.2 U13.5(EN)
EN2: H6.2 U14.5(EN)
EN3: H7.2 U7.5(EN)
EN_5450_1: U4.5(ENA)
EN_55340: H4.2 Q3.3(D) R15.2 U1.4(EN)
EP: C2.1 C3.2 C4.1 C5.1 C6.1 C7.1 C8.1 C10.2 C12.1 C15.2 C16.1 C18.2 C19.1 C20.1 C21.2 C22.2 C23.2 C30.2 C31.2 C32.2 C35.1 C37.1 C38.2 C40.1 C45.1 C47.1 C62.1 C64.1 C67.1 C69.1 C70.2 C71.2 C72.2 C73.2 D3.2(K) H2.1 H5.4 H6.3 L6.2 LED1.1(K) Q5.2(D) R18.1 R19.1 R28.1 R32.2 R57.1 R59.1 R63.2 R64.2 U1.11(NC) U1.12(PGND) U1.13(PGND) U1.14(PGND) U3.19(PGND) U3.24(PGND) U3.29(EP) U4.6(GND) U4.9(PowerPAD) U7.1(GND) U9.3(GND) U11.2(V-) U11.4(DIVIDER) U13.1(GND) U14.1(GND)
FAULT#: H2.4 U3.2(FAULT#)
GAIN_0: H3.2 U3.5(GAIN0)
GAIN_1: H3.1 U3.6(GAIN1)
GVDD: U3.9(GVDD)
IN+: R21.1 R24.2 R25.1 U6.1(OUT1)
IN-: R20.1 R26.2 U6.7(OUT2)
INL+_PRE: R54.2 R54.5 U6.3(IN1+) U12.3(IN1+)
L+: C54.2 CN1.4 R42.1
PLIMIT: U3.10(PLIMIT)
PWM_IN: R65.1
R+: C55.1 CN1.5 R43.1
SD#: LED1.2(A) R27.2 U3.1(SD#)
SYNC: C1.1 H4.1 U1.6(SYNC)
VU_L: D6.2(A) R56.2 U12.1(OUT1)
$1N1243: R1.1 U1.10(FREQ)
$1N1251: C1.2 U1.5(SS)
$1N1256: D1.1(A) L1.2 U1.1(SW) U1.2(SW)
$1N1257: R2.1 R4.2
$1N1259: R3.1 R4.1 U1.9(FB)
$1N1260: R5.1 U1.8(COMP)
$1N1261: C9.1 R5.2
$1N1268: C13.2 U4.1(BOOT)
$1N1269: C13.1 D3.1(A) L2.1 U4.8(PH)
$1N1273: R11.1 R14.1 U4.4(VSENSE)
$1N2047: Q1.2(E) Q2.3(C) U5.8(V+)
$1N2049: Q3.2(S) R17.1
$1N2050: D4.1(K) Q4.1(G) R16.1 U5.1(OUT)
$1N2051: Q3.1(G) R16.2
$1N2061: Q2.1(B) R13.2
$1N2062: Q1.1(B) R12.2
$1N4412: K1.4 Q4.2(S)
$1N7340: Q5.1(G) R65.2
$2N1692: C26.1 C34.1 L4.1 U3.18(OUTPR) U3.20(OUTNR)
$2N1693: C24.1 C33.2 L3.1 U3.23(OUTNL) U3.25(OUTPL)
$2N1694: C29.1 R21.2
$2N1695: C28.2 U3.11(RINN)
$2N1697: C29.2 U3.12(RINP)
$2N1698: R22.2 U3.14(PBTL)
$2N1709: C24.2 U3.22(BSNL) U3.26(BSPL)
$2N1714: C26.2 U3.17(BSPR) U3.21(BSNR)
$2N1723: C25.2 R10.2 U3.7(AVCC)
$2N1725: C28.1 R20.2
$2N3339: R23.2 R24.1 U6.2(IN1-)
$2N3344: R25.2 R26.1 U6.6(IN2-)
$2N3625: H2.2 R27.1
$3N912: R31.1 R32.1 U7.4(FB)
$3N913: C36.1 L5.1 U7.2(SW)
$3N916: C36.2 U7.6(BOOT)
$3N920: LED3.2(A) R30.2
$3N1793: C48.2 U9.2(CAP+)
$3N1802: C44.2 C48.1 U9.4(CAP–)
$3N1996: D5.1(K) U9.5(VOUT)
$3N3049: LED4.1(K) R9.2
$5N981: R44.6 R45.2
$5N1180: C56.1 R44.5
$5N1185: C57.1 R44.2
$5N1191: C54.1 R45.1 R47.1
$5N1196: C55.2 R46.1 R48.1
$5N1448: C59.1 R48.2 R49.3
$5N1622: R49.2 R52.1
$5N1741: R49.5 R53.1
$5N1768: C56.2 C60.1 R53.2 R54.6
$5N2402: C57.2 C61.2 R52.2 R54.3
$5N2454: R44.3 R46.2
$5N2502: C59.2 R49.1 R50.1
$5N2537: C58.2 R49.4 R51.1
$5N2546: C58.1 R47.2 R49.6
$6N885: LED20.1(K) U11.1(LED/NO.1)
$6N891: LED14.1(K) U11.15(LED/NO.5)
$6N892: LED15.1(K) U11.14(LED/NO.6)
$6N893: LED12.1(K) U11.17(LED/NO.3)
$6N894: LED13.1(K) U11.16(LED/NO.4)
$6N895: LED11.1(K) U11.18(LED/NO.2)
$6N896: LED16.1(K) U11.13(LED/NO.7)
$6N897: LED17.1(K) U11.12(LED/NO.8)
$6N898: LED19.1(K) U11.10(LED/NO.10)
$6N899: LED18.1(K) U11.11(LED/NO.9)
$6N900: R55.2 R56.1 U12.2(IN1-)
$6N910: R57.2 R58.1 U11.8(REFRENCE/ADJUST)
$6N911: R58.2 U11.7(REFRENCE/OUTPUT)
$6N961: D6.1(K) U11.5(SIGNAL/INPUT)
$7N1047: C63.1 L7.1 U13.2(SW)
$7N1050: C63.2 U13.6(BOOT)
$7N1059: R61.1 R63.1 U13.4(FB)
$7N1060: C68.1 L8.1 U14.2(SW)
$7N1063: C68.2 U14.6(BOOT)
$7N1069: R62.2 R64.1 U14.4(FB)

Not connected (* = marked no-connect by the designer): CN1 6* 7*; L3 2; L4 2; U3 13(NC)*; U4 2(NC)* 3(NC)*; U5 5(+IN)* 6(-IN)* 7(OUT)*; U9 1(NC)* 6(LV)* 7(OSC)*; U10 4(INPUT)*; U15 1(EN) 2(GND) 3(SW) 4(VIN) 5(FB)

## Notes on the sheets
sheet 1
- 55340的ss引脚连接的电容没有接地
- 55340的EN引脚与SYNC引脚应保持距离，两者耐压不同
- 55340的焊接方向比较反人类
- 5430－54302的EN脚最大输入7V,无分压en网络会烧坏
- 5450无DC5525接口
- 5450的输出二极管方向反了！！！！
- 5450的底部焊盘无穿孔
- 自动继电器切换装置无效：推挽输入电压、栅极驱动电压（运放输入电压）过低无法驱动继电器
sheet 3
- 运放用54302没有连接到18V
- 5430－54302的EN脚最大输入7V,无分压en网络会烧坏
sheet 6
- 54302的5V输出偏移过大
- +12.6V 输入
- 54302的2.2uH电感尺寸错误
- 54302的3.3V输出无效电流过小
- 警告：3.3V输出无效！！！
